# Altium project US29080671(A).PrjPCB (part 1 of 10)
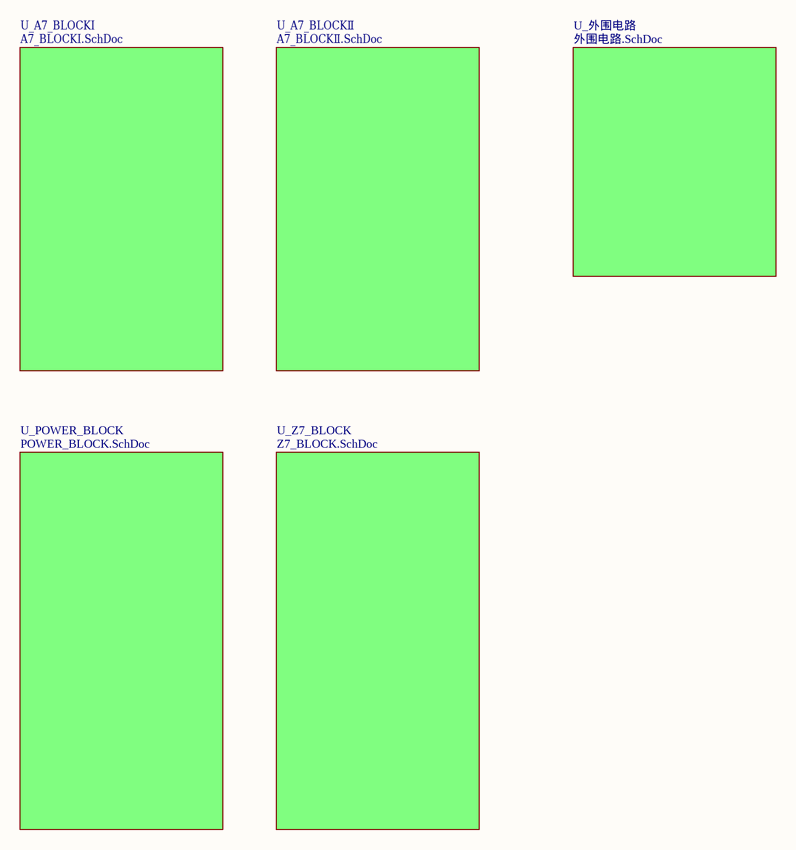
[diagram p0: US29080671.SchDoc]
42 sheets, 1097 parts. Net scope: global (net labels, ports and power ports of the same name join across sheets).
Board file: US29080671(A).PcbDoc
Sheets:
  US29080671.SchDoc
    U_A7_BLOCKⅠ = A7_BLOCKⅠ.SchDoc
      A7_BLOCK_PWR = A7_JTAG&CONFIG.SchDoc
      A7_BLOCK_PWR = A7_MGT.SchDoc
      A7_BLOCK_PWR = A7_POWER.SchDoc
      A7_BLOCK_PWR = A7_GND.SchDoc
      A7_BLOCK_FUN = A7_FUNCTION1.SchDoc
      A7_BLOCK_FUN = A7_FUNCTION2.SchDoc
      A7_BLOCK_FUN = A7_FUNCTION3.SchDoc
    U_A7_BLOCKⅡ = A7_BLOCKⅡ.SchDoc
      A7_BLOCK2_FUN = A7_FUNCTION1 -Ⅱ.SchDoc
      A7_BLOCK2_FUN = A7_FUNCTION2 - Ⅱ.SchDoc
      A7_BLOCK2_FUN = A7_FUNCTION3 - Ⅱ.SchDoc
      A7_BLOCK2_PWR = A7_JTAG&CONFIG - Ⅱ.SchDoc
      A7_BLOCK2_PWR = A7_MGT - Ⅱ.SchDoc
      A7_BLOCK2_PWR = A7_POWER - Ⅱ.SchDoc
      A7_BLOCK2_PWR = A7_GND - Ⅱ.SchDoc
    U_POWER_BLOCK = POWER_BLOCK.SchDoc
      U_POWER_B1 = POWER_B1.SchDoc
      U_POWER_B2 = POWER_B2.SchDoc
      U_POWER_B3 = POWER_B3.SchDoc
      U_MY_beamControl_R_组件电源分配 = MY_beamControl_R_组件电源分配.SchDoc
    U_Z7_BLOCK = Z7_BLOCK.SchDoc
      U_Z7_POWER&JTAG = Z7_POWER1.SchDoc
      U_Z7_POWER&JTAG = Z7_POWER2.SchDoc
      U_Z7_POWER&JTAG = Z7_JTAG&DEBUG.SchDoc
      U_Z7_ARM = Z7_USB.SchDoc
      U_Z7_ARM = Z7_BANK_DDR3.SchDoc
      U_Z7_ARM = Z7_DDR3.SchDoc
      U_Z7_ARM = Z7_BANK500_501.SchDoc
      U_Z7_ARM = Z7_ETHERNET.SchDoc
      U_Z7_ARM = Z7_STORAGE.SchDoc
      U_Z7_ARM = Z7_MGTX.SchDoc
      U_Z7_FUNCTION = Z7_FUNCTION1.SchDoc
      U_Z7_FUNCTION = Z7_FUNCTION2.SchDoc
      U_Z7_FUNCTION = Z7_FUNCTION3.SchDoc
      U_ZYNQ_reset = ZYNQ_reset.SchDoc
    U_外围电路 = 外围电路.SchDoc
      U_MY_beamControl_R_对内接口 = MY_beamControl_R_对内接口.SchDoc
      U_MY_beamControl_R_对外接口 = MY_beamControl_R_对外接口.SchDoc
      U_MY_beamControl_R电平转换 = MY_beamControl_R电平转换.SchDoc
      U_MY_beamControl_R_风扇供电接口 = MY_beamControl_R_风扇供电接口.SchDoc

## Sheet US29080671.SchDoc
size A4

### Sub-sheets
U_A7_BLOCKⅠ = A7_BLOCKⅠ.SchDoc: no entries
U_A7_BLOCKⅡ = A7_BLOCKⅡ.SchDoc: no entries
U_POWER_BLOCK = POWER_BLOCK.SchDoc: no entries
U_Z7_BLOCK = Z7_BLOCK.SchDoc: no entries
U_外围电路 = 外围电路.SchDoc: no entries

## Sheet A7_BLOCKⅠ.SchDoc
size A4
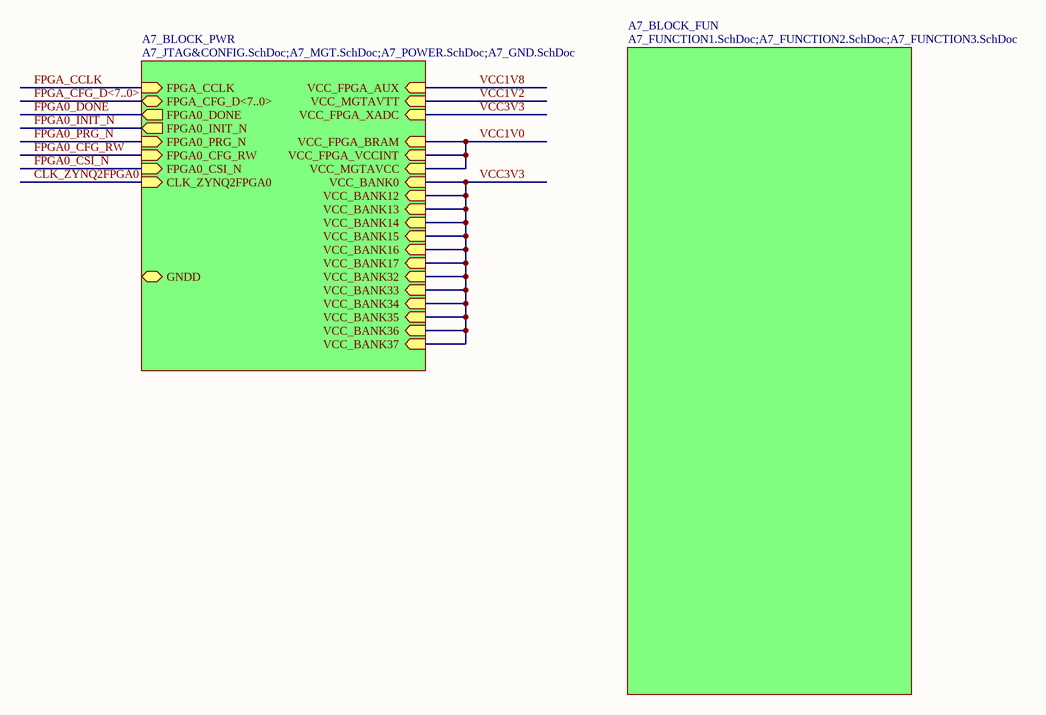
[diagram p1: A7_BLOCKⅠ.SchDoc]

### Sub-sheets
A7_BLOCK_FUN = A7_FUNCTION1.SchDoc;A7_FUNCTION2.SchDoc;A7_FUNCTION3.SchDoc: no entries
A7_BLOCK_PWR = A7_JTAG&CONFIG.SchDoc;A7_MGT.SchDoc;A7_POWER.SchDoc;A7_GND.SchDoc: FPGA_CCLK (in), FPGA0_DONE (out), FPGA0_INIT_N (out), FPGA0_PRG_N (in), GNDD, FPGA_CFG_D<7..0>, CLK_ZYNQ2FPGA0 (in), FPGA0_CFG_RW (in), FPGA0_CSI_N (in), VCC_MGTAVCC (in), VCC_MGTAVTT (in), VCC_BANK0 (in), VCC_FPGA_XADC (in), VCC_FPGA_BRAM (in), VCC_FPGA_VCCINT (in), VCC_FPGA_AUX (in), VCC_BANK12 (in), VCC_BANK13 (in), VCC_BANK14 (in), VCC_BANK15 (in), VCC_BANK16 (in), VCC_BANK17 (in), VCC_BANK32 (in), VCC_BANK33 (in), VCC_BANK34 (in), VCC_BANK35 (in), VCC_BANK36 (in), VCC_BANK37 (in)

### Nets
VCC1V0: sheet A7_BLOCK_PWR/VCC_MGTAVCC, sheet A7_BLOCK_PWR/VCC_FPGA_BRAM, sheet A7_BLOCK_PWR/VCC_FPGA_VCCINT
VCC3V3: sheet A7_BLOCK_PWR/VCC_BANK0, sheet A7_BLOCK_PWR/VCC_FPGA_XADC, sheet A7_BLOCK_PWR/VCC_BANK12, sheet A7_BLOCK_PWR/VCC_BANK13, sheet A7_BLOCK_PWR/VCC_BANK14, sheet A7_BLOCK_PWR/VCC_BANK15, sheet A7_BLOCK_PWR/VCC_BANK16, sheet A7_BLOCK_PWR/VCC_BANK17, sheet A7_BLOCK_PWR/VCC_BANK32, sheet A7_BLOCK_PWR/VCC_BANK33, sheet A7_BLOCK_PWR/VCC_BANK34, sheet A7_BLOCK_PWR/VCC_BANK35, sheet A7_BLOCK_PWR/VCC_BANK36, sheet A7_BLOCK_PWR/VCC_BANK37

### Buses and harness runs
bus FPGA_CFG_D<7..0> = sheet A7_BLOCK_PWR/FPGA_CFG_D<7..0>

## Sheet A7_JTAG&CONFIG.SchDoc
size A3
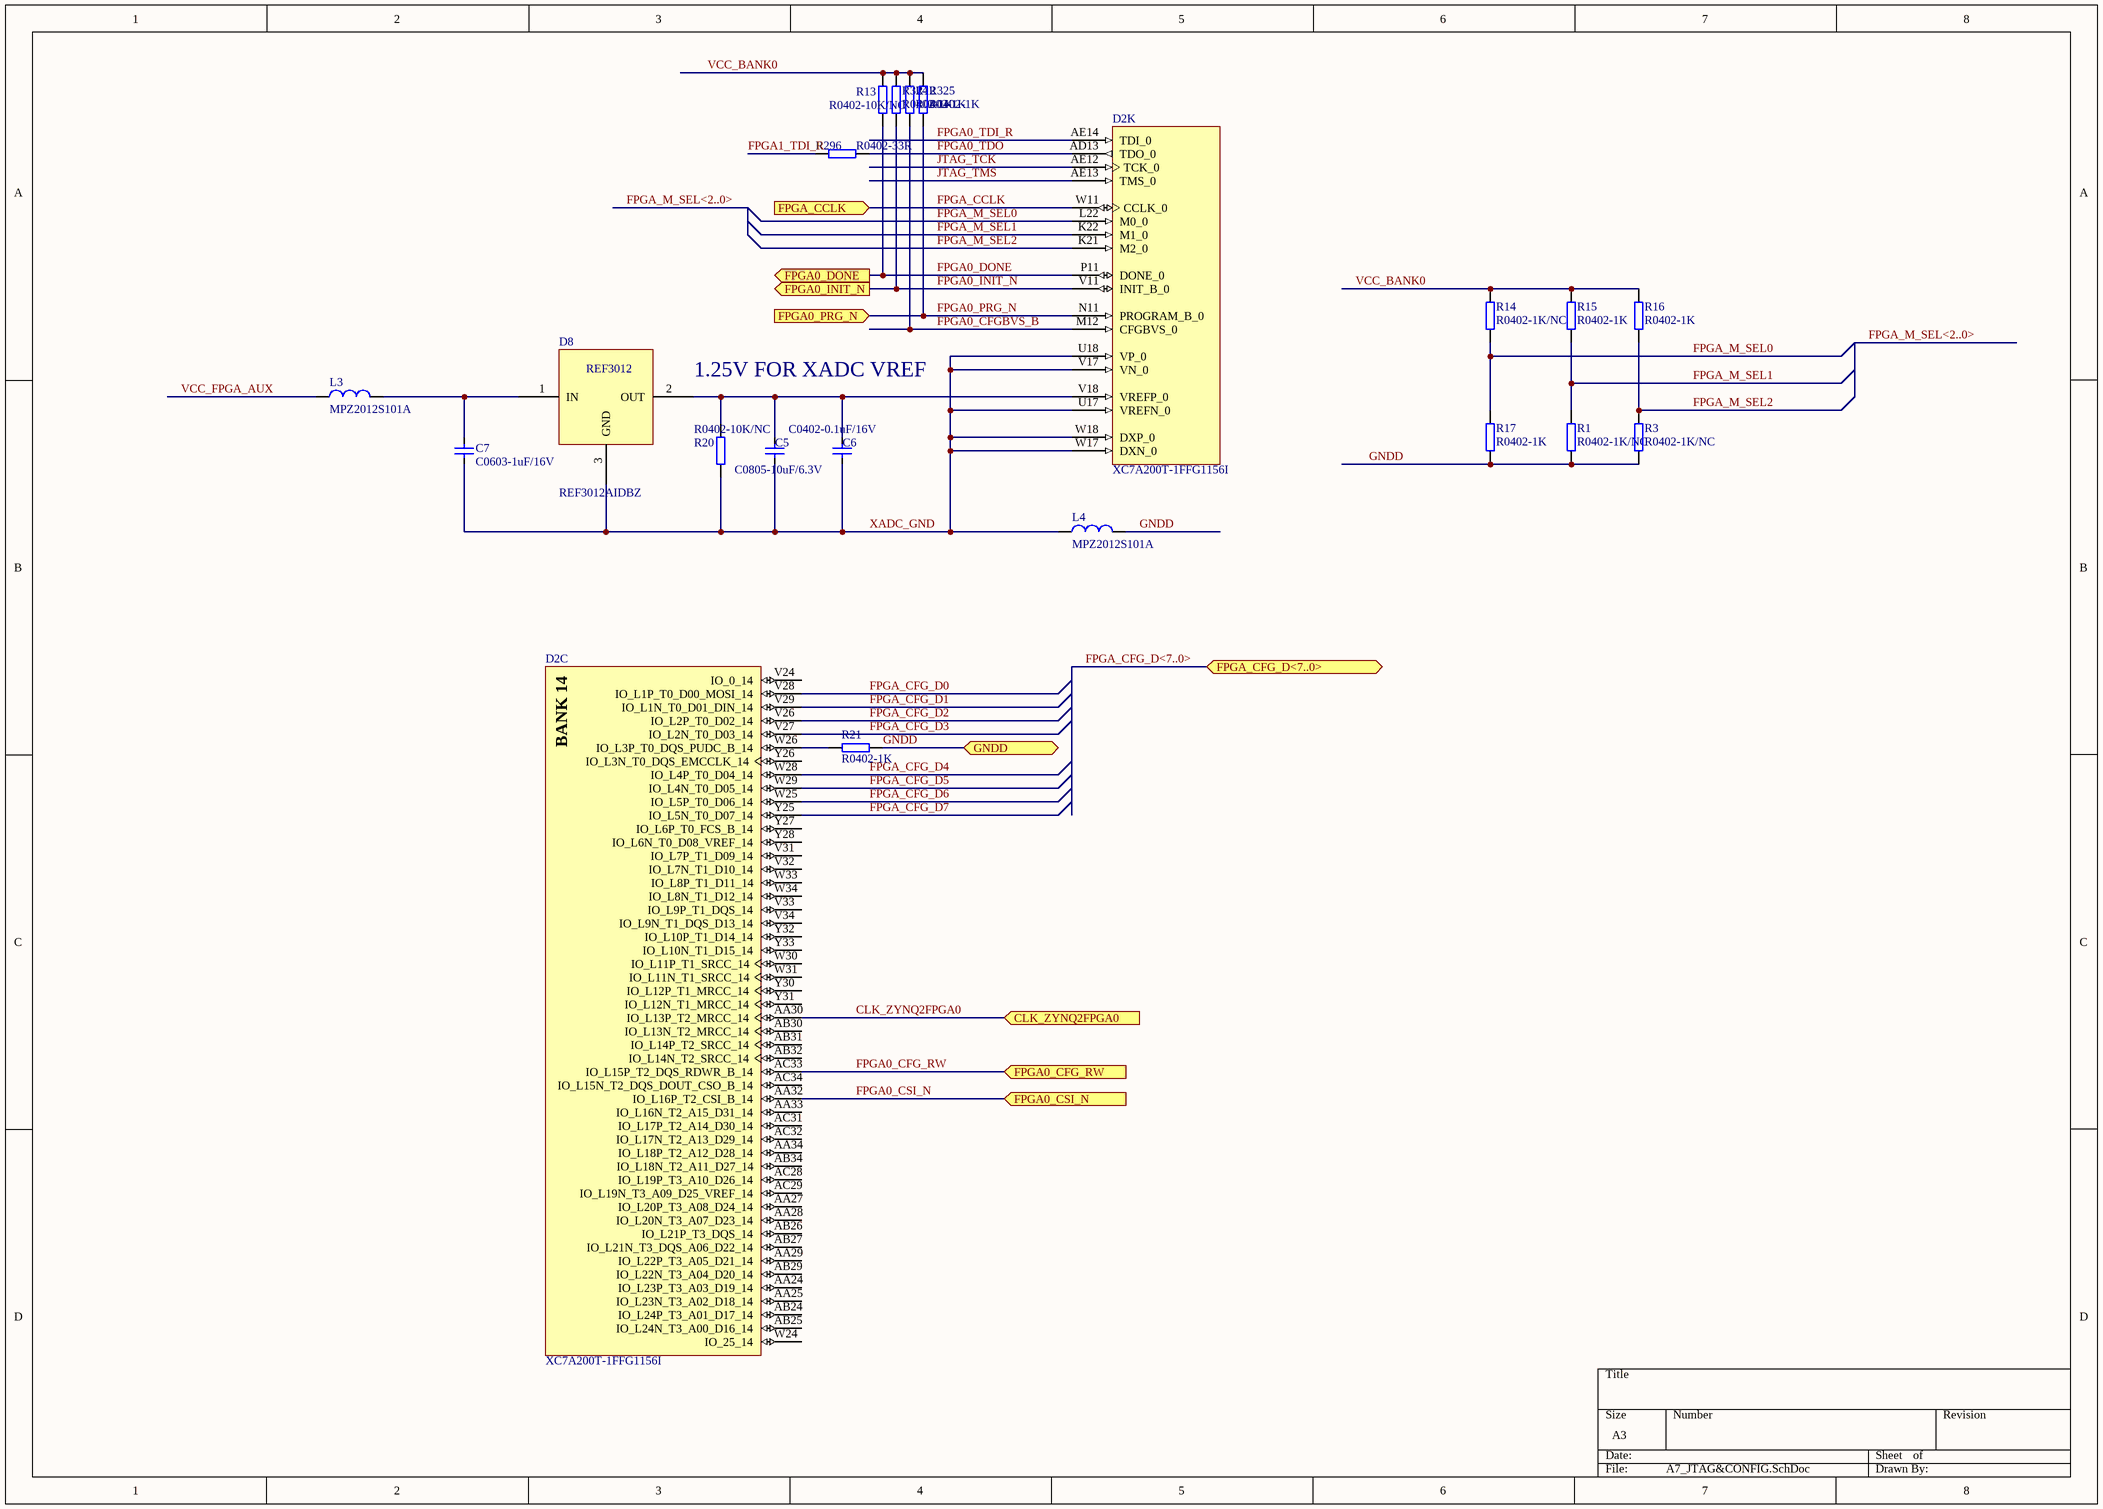
[diagram p2: A7_JTAG&CONFIG.SchDoc]

### Parts
C5  C0805-10uF/6.3V  [C0805]
C6  C0402-0.1uF/16V  [C0402]
C7  C0603-1uF/16V  [C0603]
D2  XC7A200T-1FFG1156I  [FFG1156]  (parts C,K of 18)
D8  REF3012AIDBZ  [SOT-23]
L3  MPZ2012S101A  [R0805]
L4  MPZ2012S101A  [R0805]
R1  R0402-1K/NC  [R0402]
R3  R0402-1K/NC  [R0402]
R12  R0402-1K  [R0402]
R13  R0402-10K/NC  [R0402]
R14  R0402-1K/NC  [R0402]
R15  R0402-1K  [R0402]
R16  R0402-1K  [R0402]
R17  R0402-1K  [R0402]
R20  R0402-10K/NC  [R0402]
R21  R0402-1K  [R0402]
R296  R0402-33R  [R0402]
R324  R0402-1K  [R0402]
R325  R0402-1K  [R0402]

### Ports
CLK_ZYNQ2FPGA0 (in), FPGA0_CFG_RW (in), FPGA0_CSI_N (in), FPGA0_DONE (out), FPGA0_INIT_N (out), FPGA0_PRG_N (in), FPGA_CCLK (in), FPGA_CFG_D<7..0>, GNDD

### Nets
GNDD: L4.2 R1.1 R3.1 R17.1 R21.1 ; port GNDD
VCC_BANK0: R12.2 R13.2 R14.2 R15.2 R16.2 R324.2 R325.2  [project net VCC3V3]
VCC_FPGA_AUX: L3.1  [project net VCC1V8]
CLK_ZYNQ2FPGA0: D2.AA30(IO_L13P_T2_MRCC_14) ; port CLK_ZYNQ2FPGA0
FPGA0_CFG_RW: D2.AC33(IO_L15P_T2_DQS_RDWR_B_14) ; port FPGA0_CFG_RW
FPGA0_CFGBVS_B: D2.M12(CFGBVS_0) R12.1
FPGA0_CSI_N: D2.AA32(IO_L16P_T2_CSI_B_14) ; port FPGA0_CSI_N
FPGA0_DONE: D2.P11(DONE_0) R13.1 ; port FPGA0_DONE
FPGA0_INIT_N: D2.V11(INIT_B_0) R324.1 ; port FPGA0_INIT_N
FPGA0_PRG_N: D2.N11(PROGRAM_B_0) R325.1 ; port FPGA0_PRG_N
FPGA0_TDI_R: D2.AE14(TDI_0)
FPGA0_TDO: D2.AD13(TDO_0) R296.2
FPGA1_TDI_R: R296.1
FPGA_CCLK: D2.W11(CCLK_0) ; port FPGA_CCLK
FPGA_CFG_D0: D2.V28(IO_L1P_T0_D00_MOSI_14)
FPGA_CFG_D1: D2.V29(IO_L1N_T0_D01_DIN_14)
FPGA_CFG_D2: D2.V26(IO_L2P_T0_D02_14)
FPGA_CFG_D3: D2.V27(IO_L2N_T0_D03_14)
FPGA_CFG_D4: D2.W28(IO_L4P_T0_D04_14)
FPGA_CFG_D5: D2.W29(IO_L4N_T0_D05_14)
FPGA_CFG_D6: D2.W25(IO_L5P_T0_D06_14)
FPGA_CFG_D7: D2.Y25(IO_L5N_T0_D07_14)
FPGA_M_SEL0: D2.L22(M0_0) R14.1 R17.2
FPGA_M_SEL1: D2.K22(M1_0) R1.2 R15.1
FPGA_M_SEL2: D2.K21(M2_0) R3.2 R16.1
JTAG_TCK: D2.AE12(TCK_0)
JTAG_TMS: D2.AE13(TMS_0)
XADC_GND: C5.2 C6.2 C7.2 D2.U17(VREFN_0) D2.U18(VP_0) D2.V17(VN_0) D2.W17(DXN_0) D2.W18(DXP_0) D8.3(GND) L4.1 R20.2
NetC5_1: C5.1 C6.1 D2.V18(VREFP_0) D8.2(OUT) R20.1
NetC7_1: C7.1 D8.1(IN) L3.2
NetD2_W26: D2.W26(IO_L3P_T0_DQS_PUDC_B_14) R21.2

Not connected (* = marked no-connect by the designer): D2 AA24(IO_L23P_T3_A03_D19_14) AA25(IO_L23N_T3_A02_D18_14) AA27(IO_L20P_T3_A08_D24_14) AA28(IO_L20N_T3_A07_D23_14) AA29(IO_L22P_T3_A05_D21_14) AA33(IO_L16N_T2_A15_D31_14) AA34(IO_L18P_T2_A12_D28_14) AB24(IO_L24P_T3_A01_D17_14) AB25(IO_L24N_T3_A00_D16_14) AB26(IO_L21P_T3_DQS_14) AB27(IO_L21N_T3_DQS_A06_D22_14) AB29(IO_L22N_T3_A04_D20_14) AB30(IO_L13N_T2_MRCC_14) AB31(IO_L14P_T2_SRCC_14) AB32(IO_L14N_T2_SRCC_14) AB34(IO_L18N_T2_A11_D27_14) AC28(IO_L19P_T3_A10_D26_14) AC29(IO_L19N_T3_A09_D25_VREF_14) AC31(IO_L17P_T2_A14_D30_14) AC32(IO_L17N_T2_A13_D29_14) AC34(IO_L15N_T2_DQS_DOUT_CSO_B_14) V24(IO_0_14) V31(IO_L7P_T1_D09_14) V32(IO_L7N_T1_D10_14) V33(IO_L9P_T1_DQS_14) V34(IO_L9N_T1_DQS_D13_14) W24(IO_25_14) W30(IO_L11P_T1_SRCC_14) W31(IO_L11N_T1_SRCC_14) W33(IO_L8P_T1_D11_14) W34(IO_L8N_T1_D12_14) Y26(IO_L3N_T0_DQS_EMCCLK_14) Y27(IO_L6P_T0_FCS_B_14) Y28(IO_L6N_T0_D08_VREF_14) Y30(IO_L12P_T1_MRCC_14) Y31(IO_L12N_T1_MRCC_14) Y32(IO_L10P_T1_D14_14) Y33(IO_L10N_T1_D15_14)

### Buses and harness runs
bus FPGA_CFG_D<7..0> = port FPGA_CFG_D<7..0>
bus FPGA_M_SEL<2..0>

### Notes on the sheet
- 1.25V FOR XADC VREF
- (in symbol XC7A200T-1FFG1156I, part C) BANK 14

### Library data of the parts
C5 = C1210-22uF/16V: Part_number: C0805-10uF/6.3V; Part_type: CAP; Value: C0805-10uF/6.3V; Schematic_Part: CAP; PCB_Footprint: C0805
C6 = C0402-0.1uF/16V: X7R; Manufacturer: SAMSUNG; Manufacturer_p/n: CL05X7R104KO5NNN; Part_number: C0402-0.1uF/16V; Part_type: CAP; Value: C0402-0.1uF/16V; temperature: -55℃\+125℃; Schematic_Part: CAP; PCB_Footprint: C0402; datasheet: #DataSheet\C_Samsung_General Capacitors.pdf#
C7 = C0603-100nF/16V: X7R; Part_number: C0603-1uF/16V; Part_type: CAP; Value: C0603-1uF/16V; temperature: -55℃\+125℃; Schematic_Part: CAP; PCB_Footprint: C0603
D2 = XC7A200T-1FFG1156I: Artix-7 FPGA, 500 User I/Os, 16 GTP, 1156-Ball BGA, Speed Grade 1, Industrial Grade, Pb-Free; Manufacturer: Xilinx; Block RAM Blocks (18Kb): 730; Block RAM Blocks (36Kb): 365; Block RAM Blocks (Max Kb): 13140; CLBs (Slices): 33650; Clock Mgmt Tiles (CMTs): 10; DSP48E1 Slices: 740; Logic Cells: 215360; Max User I/O: 500; Speed Grade: -1; DatasheetVersion: v1.12; PackageVersion: Rev 1.8; PackageReference: FFG1156; PackageDescription: Flip-Chip BGA, Body 35 x 35 mm, 1.0 mm Pitch; CLBs (Max Distributed RAM Kb): 2888; Generic Part Number: XC7A200T; RoHS: Pb-Free; Mounting Technology: Surface Mount; Code_JEDEC: MS-034-AAR-1; PartNumber: XC7A200T-1FFG1156I; ComponentLink1Description: Datasheet; ComponentLink1URL: http://www.xilinx.com/support/documentation/data_sheets/ds180_7Series_Overview.pdf; ComponentLink2Description: Package Specification; ComponentLink2URL: http://www.xilinx.com/support/documentation/user_guides/ug475_7Series_Pkg_Pinout.pdf; ComponentLink3Description: DC and Switching Characteristics; ComponentLink3URL: http://www.xilinx.com/support/documentation/data_sheets/ds181_Artix_7_Data_Sheet.pdf; ComponentLink4Description: Package File; ComponentLink4URL: http://www.xilinx.com/support/packagefiles/a7packages/xc7a200tfbg676pkg.txt; ComponentLink5Description: Packaging and Pinout; ComponentLink5URL: http://www.xilinx.com/support/documentation/user_guides/ug475_7Series_Pkg_Pinout.pdf
L3 L4 = FB0805-330R@100MHz: Manufacturer: TDK; Part_number: MPZ2012S101A; Part_type: BEAD; temperature: -55℃\+125℃; Value1: 330R@100MHz; Schematic_Part: BEAD; PCB_Footprint: R0805; Manufacturer_p/n: MPZ2012S101A
R1 R3 R12-R17 R20 R21 R296 R324 R325 = R0402-10K: Manufacturer: SAMSUNG; Part_type: RES; Schematic_Part: RES; PCB_Footprint: R0402
  R1 R3 R14: Part_number: R0402-1K/NC; Value: R0402-1K/NC
  R12 R15-R17 R21 R324 R325: Part_number: R0402-1K; Value: R0402-1K
  R13 R20: Part_number: R0402-10K/NC; Value: R0402-10K/NC
  R296: Part_number: R0402-33R; Value: R0402-33R
D8 = REF3012AIDBZ: Part_number: REF3012AIDBZ

## Sheet A7_MGT.SchDoc
size A3
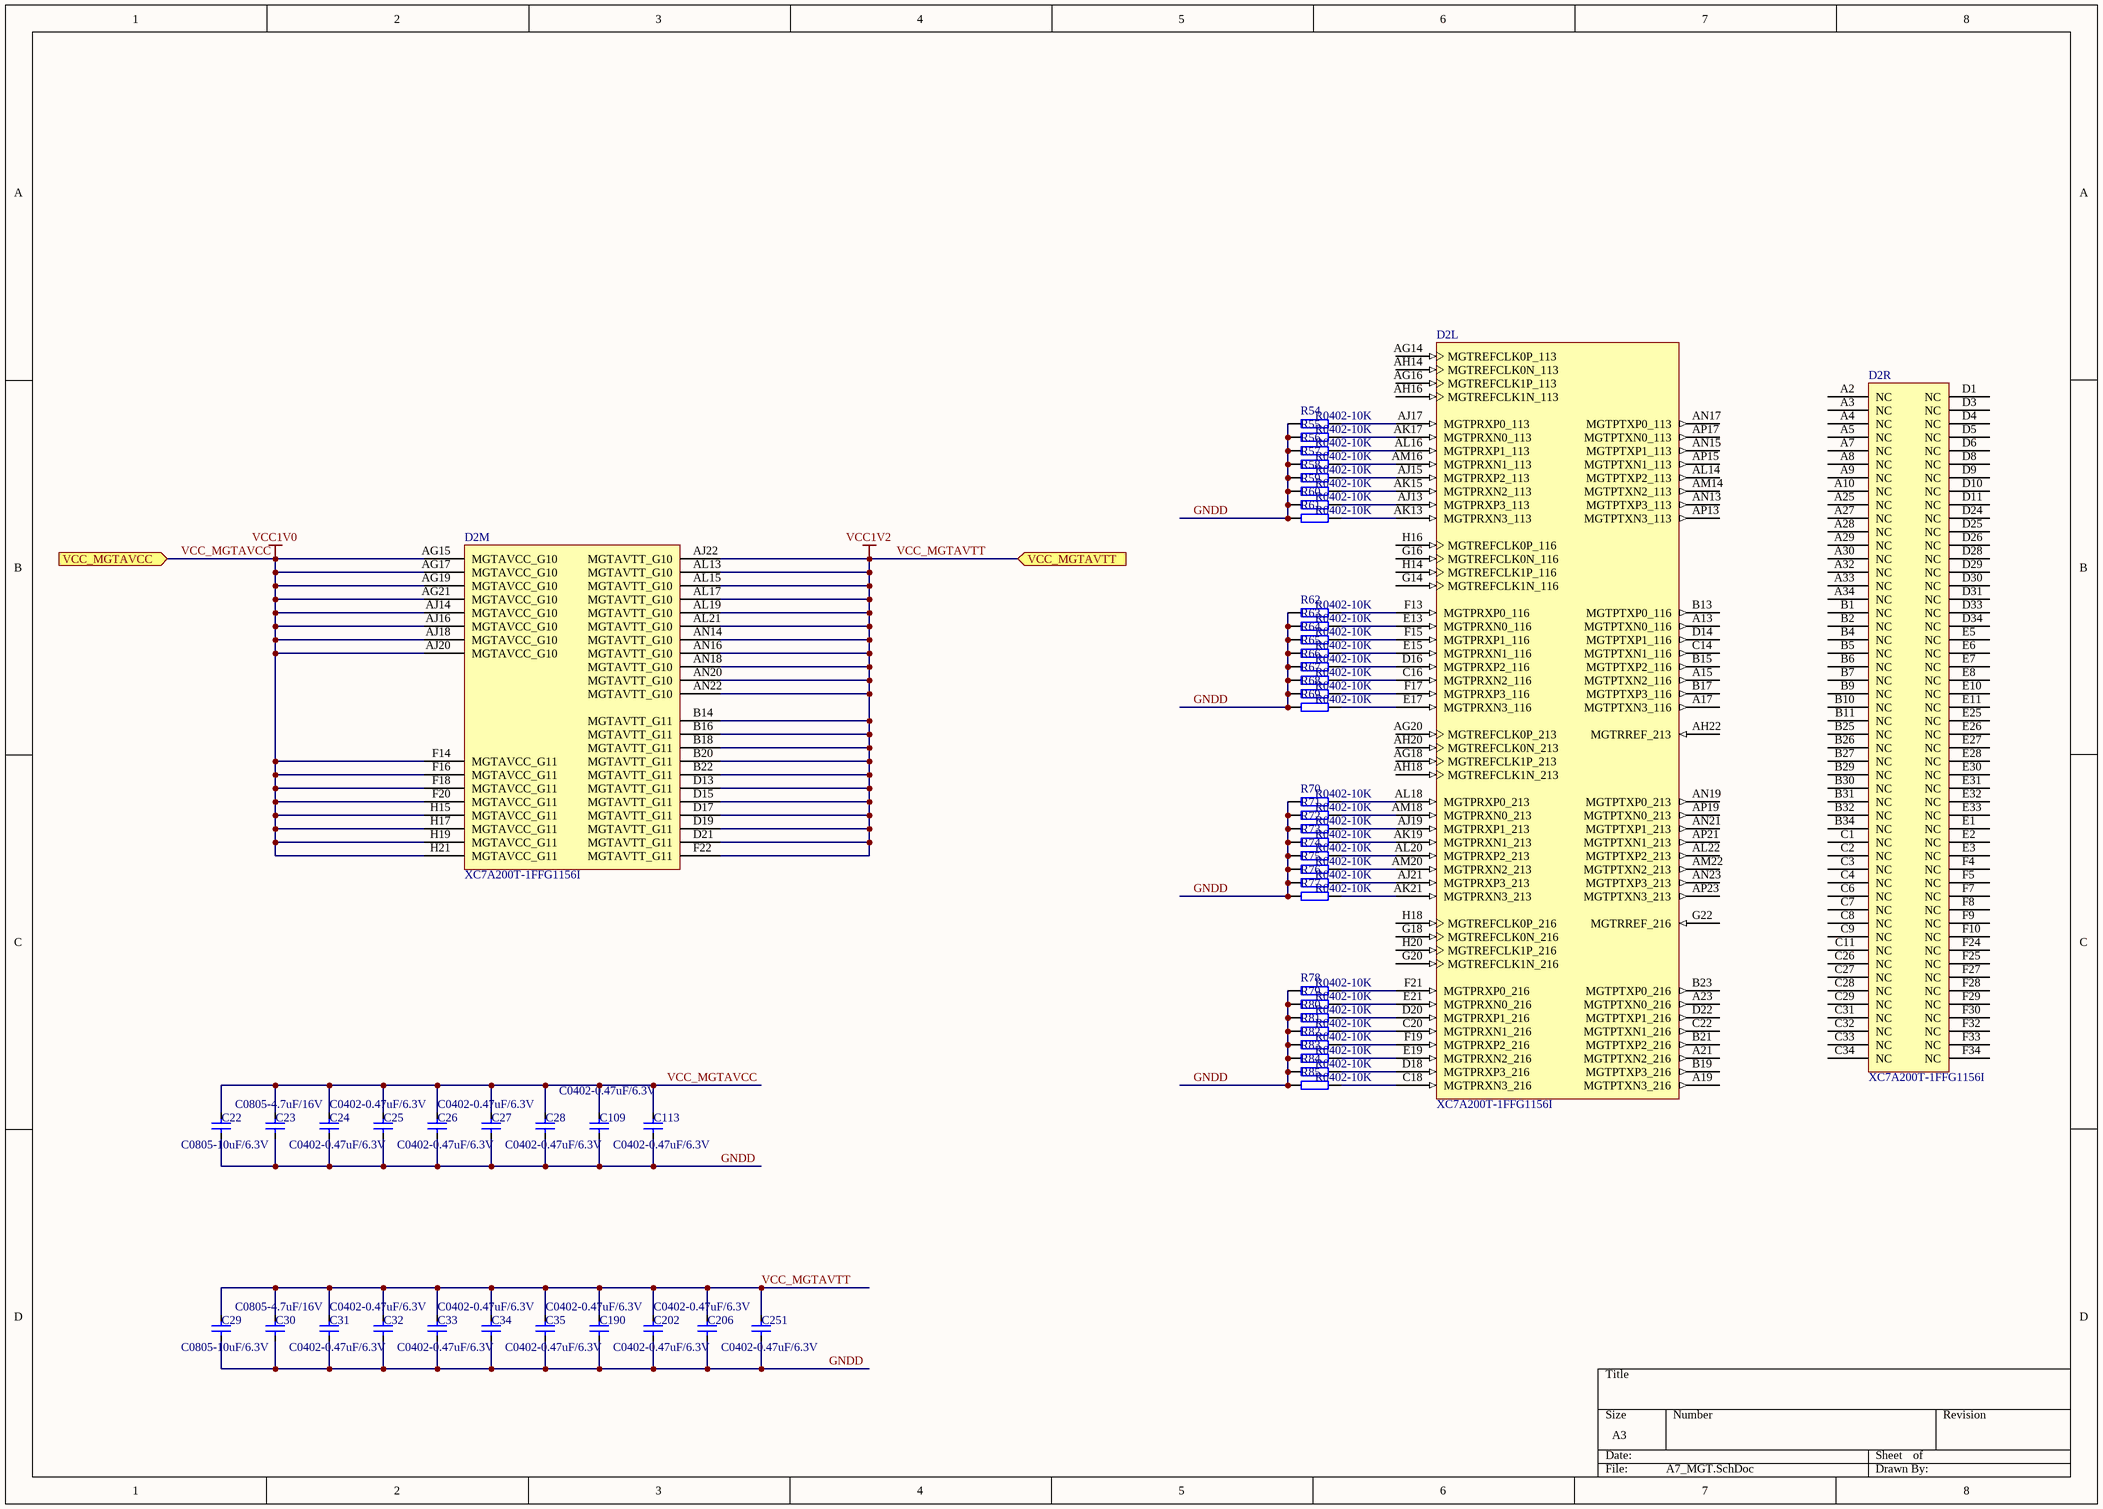
[diagram p3: A7_MGT.SchDoc]

### Parts
C22  C0805-10uF/6.3V  [C0805]
C23  C0805-4.7uF/16V  [C0805]
C24  C0402-0.47uF/6.3V  [C0402]
C25  C0402-0.47uF/6.3V  [C0402]
C26  C0402-0.47uF/6.3V  [C0402]
C27  C0402-0.47uF/6.3V  [C0402]
C28  C0402-0.47uF/6.3V  [C0402]
C29  C0805-10uF/6.3V  [C0805]
C30  C0805-4.7uF/16V  [C0805]
C31  C0402-0.47uF/6.3V  [C0402]
C32  C0402-0.47uF/6.3V  [C0402]
C33  C0402-0.47uF/6.3V  [C0402]
C34  C0402-0.47uF/6.3V  [C0402]
C35  C0402-0.47uF/6.3V  [C0402]
C109  C0402-0.47uF/6.3V  [C0402]
C113  C0402-0.47uF/6.3V  [C0402]
C190  C0402-0.47uF/6.3V  [C0402]
C202  C0402-0.47uF/6.3V  [C0402]
C206  C0402-0.47uF/6.3V  [C0402]
C251  C0402-0.47uF/6.3V  [C0402]
D2  XC7A200T-1FFG1156I  [FFG1156]  (parts L,M,R of 18)
R54  R0402-10K  [R0402]
R55  R0402-10K  [R0402]
R56  R0402-10K  [R0402]
R57  R0402-10K  [R0402]
R58  R0402-10K  [R0402]
R59  R0402-10K  [R0402]
R60  R0402-10K  [R0402]
R61  R0402-10K  [R0402]
R62  R0402-10K  [R0402]
R63  R0402-10K  [R0402]
R64  R0402-10K  [R0402]
R65  R0402-10K  [R0402]
R66  R0402-10K  [R0402]
R67  R0402-10K  [R0402]
R68  R0402-10K  [R0402]
R69  R0402-10K  [R0402]
R70  R0402-10K  [R0402]
R71  R0402-10K  [R0402]
R72  R0402-10K  [R0402]
R73  R0402-10K  [R0402]
R74  R0402-10K  [R0402]
R75  R0402-10K  [R0402]
R76  R0402-10K  [R0402]
R77  R0402-10K  [R0402]
R78  R0402-10K  [R0402]
R79  R0402-10K  [R0402]
R80  R0402-10K  [R0402]
R81  R0402-10K  [R0402]
R82  R0402-10K  [R0402]
R83  R0402-10K  [R0402]
R84  R0402-10K  [R0402]
R85  R0402-10K  [R0402]

### Ports
VCC_MGTAVCC (in), VCC_MGTAVTT (in)

### Nets
GNDD: C22.2 C23.2 C24.2 C25.2 C26.2 C27.2 C28.2 C29.2 C30.2 C31.2 C32.2 C33.2 C34.2 C35.2 C109.2 C113.2 C190.2 C202.2 C206.2 C251.2 R54.1 R55.1 R56.1 R57.1 R58.1 R59.1 R60.1 R61.1 R62.1 R63.1 R64.1 R65.1 R66.1 R67.1 R68.1 R69.1 R70.1 R71.1 R72.1 R73.1 R74.1 R75.1 R76.1 R77.1 R78.1 R79.1 R80.1 R81.1 R82.1 R83.1 R84.1 R85.1
VCC1V0: C22.1 C23.1 C24.1 C25.1 C26.1 C27.1 C28.1 C109.1 C113.1 D2.AG15(MGTAVCC_G10) D2.AG17(MGTAVCC_G10) D2.AG19(MGTAVCC_G10) D2.AG21(MGTAVCC_G10) D2.AJ14(MGTAVCC_G10) D2.AJ16(MGTAVCC_G10) D2.AJ18(MGTAVCC_G10) D2.AJ20(MGTAVCC_G10) D2.F14(MGTAVCC_G11) D2.F16(MGTAVCC_G11) D2.F18(MGTAVCC_G11) D2.F20(MGTAVCC_G11) D2.H15(MGTAVCC_G11) D2.H17(MGTAVCC_G11) D2.H19(MGTAVCC_G11) D2.H21(MGTAVCC_G11) ; port VCC_MGTAVCC  [also labelled VCC_MGTAVCC]
VCC1V2: C29.1 C30.1 C31.1 C32.1 C33.1 C34.1 C35.1 C190.1 C202.1 C206.1 C251.1 D2.AJ22(MGTAVTT_G10) D2.AL13(MGTAVTT_G10) D2.AL15(MGTAVTT_G10) D2.AL17(MGTAVTT_G10) D2.AL19(MGTAVTT_G10) D2.AL21(MGTAVTT_G10) D2.AN14(MGTAVTT_G10) D2.AN16(MGTAVTT_G10) D2.AN18(MGTAVTT_G10) D2.AN20(MGTAVTT_G10) D2.AN22(MGTAVTT_G10) D2.B14(MGTAVTT_G11) D2.B16(MGTAVTT_G11) D2.B18(MGTAVTT_G11) D2.B20(MGTAVTT_G11) D2.B22(MGTAVTT_G11) D2.D13(MGTAVTT_G11) D2.D15(MGTAVTT_G11) D2.D17(MGTAVTT_G11) D2.D19(MGTAVTT_G11) D2.D21(MGTAVTT_G11) D2.F22(MGTAVTT_G11) ; port VCC_MGTAVTT  [also labelled VCC_MGTAVTT]
NetD2_AJ13: D2.AJ13(MGTPRXP3_113) R60.2
NetD2_AJ15: D2.AJ15(MGTPRXP2_113) R58.2
NetD2_AJ17: D2.AJ17(MGTPRXP0_113) R54.2
NetD2_AJ19: D2.AJ19(MGTPRXP1_213) R72.2
NetD2_AJ21: D2.AJ21(MGTPRXP3_213) R76.2
NetD2_AK13: D2.AK13(MGTPRXN3_113) R61.2
NetD2_AK15: D2.AK15(MGTPRXN2_113) R59.2
NetD2_AK17: D2.AK17(MGTPRXN0_113) R55.2
NetD2_AK19: D2.AK19(MGTPRXN1_213) R73.2
NetD2_AK21: D2.AK21(MGTPRXN3_213) R77.2
NetD2_AL16: D2.AL16(MGTPRXP1_113) R56.2
NetD2_AL18: D2.AL18(MGTPRXP0_213) R70.2
NetD2_AL20: D2.AL20(MGTPRXP2_213) R74.2
NetD2_AM16: D2.AM16(MGTPRXN1_113) R57.2
NetD2_AM18: D2.AM18(MGTPRXN0_213) R71.2
NetD2_AM20: D2.AM20(MGTPRXN2_213) R75.2
NetD2_C16: D2.C16(MGTPRXN2_116) R67.2
NetD2_C18: D2.C18(MGTPRXN3_216) R85.2
NetD2_C20: D2.C20(MGTPRXN1_216) R81.2
NetD2_D16: D2.D16(MGTPRXP2_116) R66.2
NetD2_D18: D2.D18(MGTPRXP3_216) R84.2
NetD2_D20: D2.D20(MGTPRXP1_216) R80.2
NetD2_E13: D2.E13(MGTPRXN0_116) R63.2
NetD2_E15: D2.E15(MGTPRXN1_116) R65.2
NetD2_E17: D2.E17(MGTPRXN3_116) R69.2
NetD2_E19: D2.E19(MGTPRXN2_216) R83.2
NetD2_E21: D2.E21(MGTPRXN0_216) R79.2
NetD2_F13: D2.F13(MGTPRXP0_116) R62.2
NetD2_F15: D2.F15(MGTPRXP1_116) R64.2
NetD2_F17: D2.F17(MGTPRXP3_116) R68.2
NetD2_F19: D2.F19(MGTPRXP2_216) R82.2
NetD2_F21: D2.F21(MGTPRXP0_216) R78.2

Not connected (* = marked no-connect by the designer): D2 A2(NC) A3(NC) A4(NC) A5(NC) A7(NC) A8(NC) A9(NC) A10(NC) A13(MGTPTXN0_116) A15(MGTPTXN2_116) A17(MGTPTXN3_116) A19(MGTPTXN3_216) A21(MGTPTXN2_216) A23(MGTPTXN0_216) A25(NC) A27(NC) A28(NC) A29(NC) A30(NC) A32(NC) A33(NC) A34(NC) AG14(MGTREFCLK0P_113) AG16(MGTREFCLK1P_113) AG18(MGTREFCLK1P_213) AG20(MGTREFCLK0P_213) AH14(MGTREFCLK0N_113) AH16(MGTREFCLK1N_113) AH18(MGTREFCLK1N_213) AH20(MGTREFCLK0N_213) AH22(MGTRREF_213) AL14(MGTPTXP2_113) AL22(MGTPTXP2_213) AM14(MGTPTXN2_113) AM22(MGTPTXN2_213) AN13(MGTPTXP3_113) AN15(MGTPTXP1_113) AN17(MGTPTXP0_113) AN19(MGTPTXP0_213) AN21(MGTPTXP1_213) AN23(MGTPTXP3_213) AP13(MGTPTXN3_113) AP15(MGTPTXN1_113) AP17(MGTPTXN0_113) AP19(MGTPTXN0_213) AP21(MGTPTXN1_213) AP23(MGTPTXN3_213) B1(NC) B2(NC) B4(NC) B5(NC) B6(NC) B7(NC) B9(NC) B10(NC) B11(NC) B13(MGTPTXP0_116) B15(MGTPTXP2_116) B17(MGTPTXP3_116) B19(MGTPTXP3_216) B21(MGTPTXP2_216) B23(MGTPTXP0_216) B25(NC) B26(NC) B27(NC) B29(NC) B30(NC) B31(NC) B32(NC) B34(NC) C1(NC) C2(NC) C3(NC) C4(NC) C6(NC) C7(NC) C8(NC) C9(NC) C11(NC) C14(MGTPTXN1_116) C22(MGTPTXN1_216) C26(NC) C27(NC) C28(NC) C29(NC) C31(NC) C32(NC) C33(NC) C34(NC) D1(NC) D3(NC) D4(NC) D5(NC) D6(NC) D8(NC) D9(NC) D10(NC) D11(NC) D14(MGTPTXP1_116) D22(MGTPTXP1_216) D24(NC) D25(NC) D26(NC) D28(NC) D29(NC) D30(NC) D31(NC) D33(NC) D34(NC) E1(NC) E2(NC) E3(NC) E5(NC) E6(NC) E7(NC) E8(NC) E10(NC) E11(NC) E25(NC) E26(NC) E27(NC) E28(NC) E30(NC) E31(NC) E32(NC) E33(NC) F4(NC) F5(NC) F7(NC) F8(NC) F9(NC) F10(NC) F24(NC) F25(NC) F27(NC) F28(NC) F29(NC) F30(NC) F32(NC) F33(NC) F34(NC) G14(MGTREFCLK1N_116) G16(MGTREFCLK0N_116) G18(MGTREFCLK0N_216) G20(MGTREFCLK1N_216) G22(MGTRREF_216) H14(MGTREFCLK1P_116) H16(MGTREFCLK0P_116) H18(MGTREFCLK0P_216) H20(MGTREFCLK1P_216)

### Library data of the parts
C22 C29 = C1210-22uF/16V: Part_number: C0805-10uF/6.3V; Part_type: CAP; Value: C0805-10uF/6.3V; Schematic_Part: CAP; PCB_Footprint: C0805
C23 C30 = C0805-4.7uF/50V: X7R; Manufacturer: SAMSUNG; Part_number: C0805-4.7uF/16V; Part_type: CAP; Value: C0805-4.7uF/16V; Schematic_Part: CAP; PCB_Footprint: C0805; datasheet: #DataSheet\C_Samsung_General Capacitors.pdf#
C24-C28 C31-C35 C109 C113 C190 C202 C206 C251 = C0402-0.1uF/16V: as C6 on sheet A7_JTAG&CONFIG; Part_number: C0402-0.47uF/6.3V; Part_type: CAP; Value: C0402-0.47uF/6.3V; temperature: -55℃\+125℃; Schematic_Part: CAP; PCB_Footprint: C0402; datasheet: #DataSheet\C_Samsung_General Capacitors.pdf#
D2 = XC7A200T-1FFG1156I: as D2 on sheet A7_JTAG&CONFIG; DatasheetVersion: v1.12; PackageVersion: Rev 1.8; PackageReference: FFG1156; PackageDescription: Flip-Chip BGA, Body 35 x 35 mm, 1.0 mm Pitch; CLBs (Max Distributed RAM Kb): 2888; Generic Part Number: XC7A200T; RoHS: Pb-Free; Mounting Technology: Surface Mount; Code_JEDEC: MS-034-AAR-1; PartNumber: XC7A200T-1FFG1156I; ComponentLink1Description: Datasheet; ComponentLink1URL: http://www.xilinx.com/support/documentation/data_sheets/ds180_7Series_Overview.pdf; ComponentLink2Description: Package Specification; ComponentLink2URL: http://www.xilinx.com/support/documentation/user_guides/ug475_7Series_Pkg_Pinout.pdf; ComponentLink3Description: DC and Switching Characteristics; ComponentLink3URL: http://www.xilinx.com/support/documentation/data_sheets/ds181_Artix_7_Data_Sheet.pdf; ComponentLink4Description: Package File; ComponentLink4URL: http://www.xilinx.com/support/packagefiles/a7packages/xc7a200tfbg676pkg.txt; ComponentLink5Description: Packaging and Pinout; ComponentLink5URL: http://www.xilinx.com/support/documentation/user_guides/ug475_7Series_Pkg_Pinout.pdf
R54-R85 = R0402-10K: Manufacturer: SAMSUNG; Part_number: R0402-10K; Part_type: RES; Value: R0402-10K; Schematic_Part: RES; PCB_Footprint: R0402

## Sheet A7_POWER.SchDoc
size A3
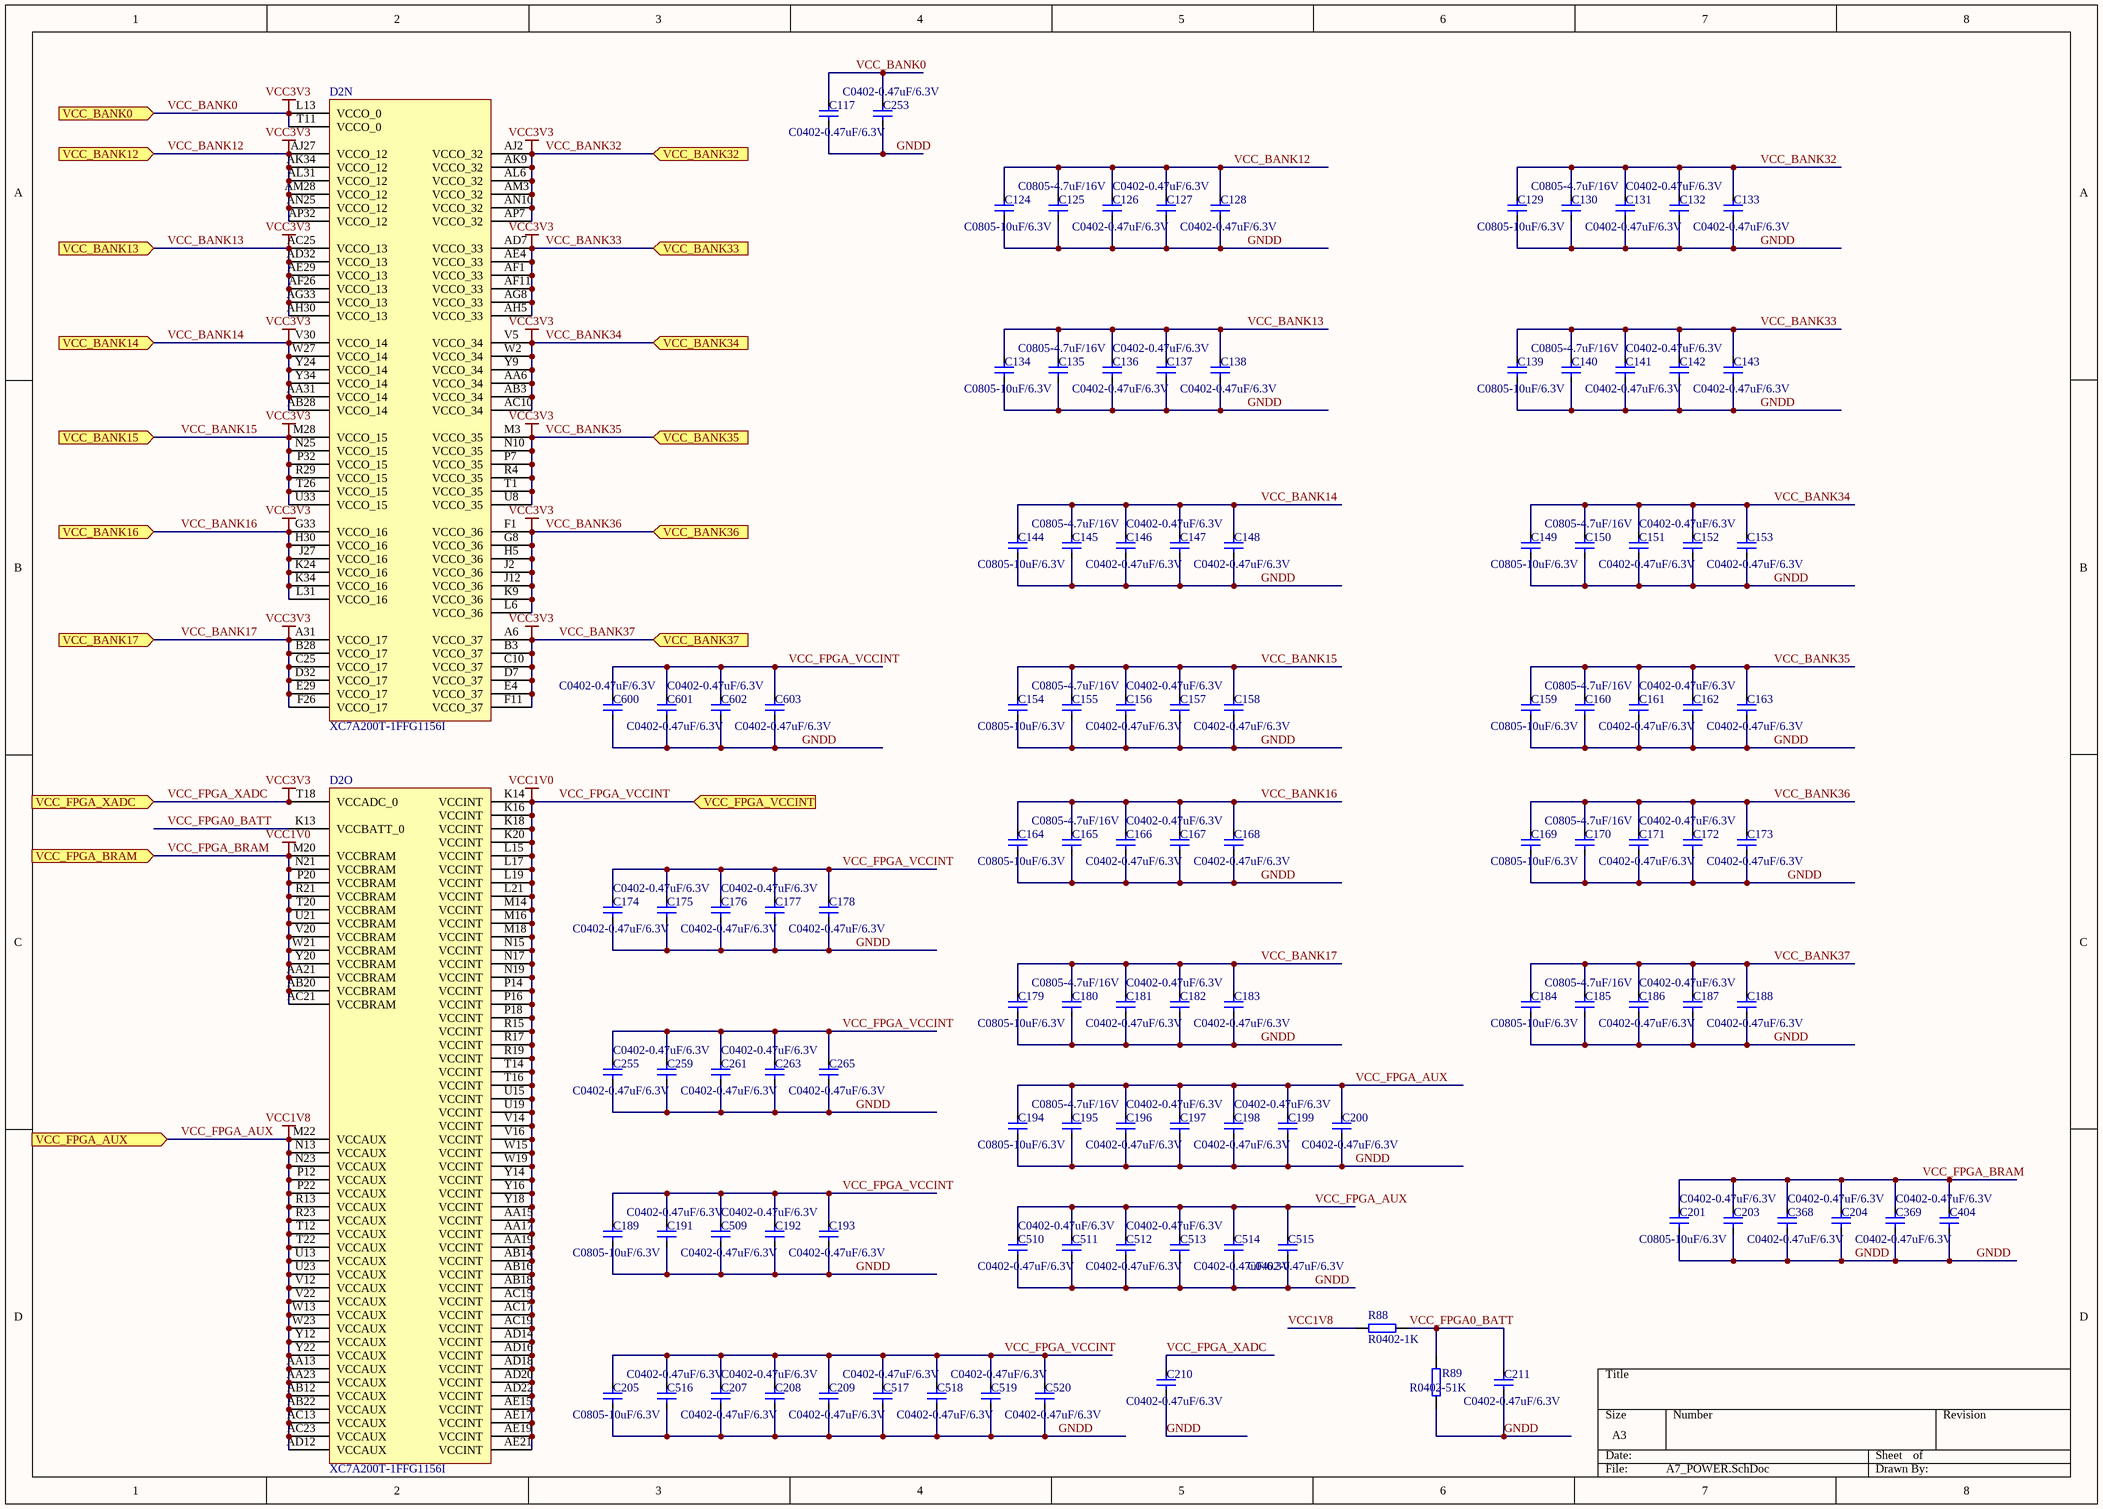
[diagram p4: A7_POWER.SchDoc]

### Parts
C117  C0402-0.47uF/6.3V  [C0402]
C124  C0805-10uF/6.3V  [C0805]
C125  C0805-4.7uF/16V  [C0805]
C126  C0402-0.47uF/6.3V  [C0402]
C127  C0402-0.47uF/6.3V  [C0402]
C128  C0402-0.47uF/6.3V  [C0402]
C129  C0805-10uF/6.3V  [C0805]
C130  C0805-4.7uF/16V  [C0805]
C131  C0402-0.47uF/6.3V  [C0402]
C132  C0402-0.47uF/6.3V  [C0402]
C133  C0402-0.47uF/6.3V  [C0402]
C134  C0805-10uF/6.3V  [C0805]
C135  C0805-4.7uF/16V  [C0805]
C136  C0402-0.47uF/6.3V  [C0402]
C137  C0402-0.47uF/6.3V  [C0402]
C138  C0402-0.47uF/6.3V  [C0402]
C139  C0805-10uF/6.3V  [C0805]
C140  C0805-4.7uF/16V  [C0805]
C141  C0402-0.47uF/6.3V  [C0402]
C142  C0402-0.47uF/6.3V  [C0402]
C143  C0402-0.47uF/6.3V  [C0402]
C144  C0805-10uF/6.3V  [C0805]
C145  C0805-4.7uF/16V  [C0805]
C146  C0402-0.47uF/6.3V  [C0402]
C147  C0402-0.47uF/6.3V  [C0402]
C148  C0402-0.47uF/6.3V  [C0402]
C149  C0805-10uF/6.3V  [C0805]
C150  C0805-4.7uF/16V  [C0805]
C151  C0402-0.47uF/6.3V  [C0402]
C152  C0402-0.47uF/6.3V  [C0402]
C153  C0402-0.47uF/6.3V  [C0402]
C154  C0805-10uF/6.3V  [C0805]
C155  C0805-4.7uF/16V  [C0805]
C156  C0402-0.47uF/6.3V  [C0402]
C157  C0402-0.47uF/6.3V  [C0402]
C158  C0402-0.47uF/6.3V  [C0402]
C159  C0805-10uF/6.3V  [C0805]
C160  C0805-4.7uF/16V  [C0805]
C161  C0402-0.47uF/6.3V  [C0402]
C162  C0402-0.47uF/6.3V  [C0402]
C163  C0402-0.47uF/6.3V  [C0402]
C164  C0805-10uF/6.3V  [C0805]
C165  C0805-4.7uF/16V  [C0805]
C166  C0402-0.47uF/6.3V  [C0402]
C167  C0402-0.47uF/6.3V  [C0402]
C168  C0402-0.47uF/6.3V  [C0402]
C169  C0805-10uF/6.3V  [C0805]
C170  C0805-4.7uF/16V  [C0805]
C171  C0402-0.47uF/6.3V  [C0402]
C172  C0402-0.47uF/6.3V  [C0402]
C173  C0402-0.47uF/6.3V  [C0402]
C174  C0402-0.47uF/6.3V  [C0402]
C175  C0402-0.47uF/6.3V  [C0402]
C176  C0402-0.47uF/6.3V  [C0402]
C177  C0402-0.47uF/6.3V  [C0402]
C178  C0402-0.47uF/6.3V  [C0402]
C179  C0805-10uF/6.3V  [C0805]
C180  C0805-4.7uF/16V  [C0805]
C181  C0402-0.47uF/6.3V  [C0402]
C182  C0402-0.47uF/6.3V  [C0402]
C183  C0402-0.47uF/6.3V  [C0402]
C184  C0805-10uF/6.3V  [C0805]
C185  C0805-4.7uF/16V  [C0805]
C186  C0402-0.47uF/6.3V  [C0402]
C187  C0402-0.47uF/6.3V  [C0402]
C188  C0402-0.47uF/6.3V  [C0402]
C189  C0805-10uF/6.3V  [C0805]
C191  C0402-0.47uF/6.3V  [C0402]
C192  C0402-0.47uF/6.3V  [C0402]
C193  C0402-0.47uF/6.3V  [C0402]
C194  C0805-10uF/6.3V  [C0805]
C195  C0805-4.7uF/16V  [C0805]
C196  C0402-0.47uF/6.3V  [C0402]
C197  C0402-0.47uF/6.3V  [C0402]
C198  C0402-0.47uF/6.3V  [C0402]
C199  C0402-0.47uF/6.3V  [C0402]
C200  C0402-0.47uF/6.3V  [C0402]
C201  C0805-10uF/6.3V  [C0805]
C203  C0402-0.47uF/6.3V  [C0402]
C204  C0402-0.47uF/6.3V  [C0402]
C205  C0805-10uF/6.3V  [C0805]
C207  C0402-0.47uF/6.3V  [C0402]
C208  C0402-0.47uF/6.3V  [C0402]
C209  C0402-0.47uF/6.3V  [C0402]
C210  C0402-0.47uF/6.3V  [C0402]
C211  C0402-0.47uF/6.3V  [C0402]
C253  C0402-0.47uF/6.3V  [C0402]
C255  C0402-0.47uF/6.3V  [C0402]
C259  C0402-0.47uF/6.3V  [C0402]
C261  C0402-0.47uF/6.3V  [C0402]
C263  C0402-0.47uF/6.3V  [C0402]
C265  C0402-0.47uF/6.3V  [C0402]
C368  C0402-0.47uF/6.3V  [C0402]
C369  C0402-0.47uF/6.3V  [C0402]
C404  C0402-0.47uF/6.3V  [C0402]
C509  C0402-0.47uF/6.3V  [C0402]
C510  C0402-0.47uF/6.3V  [C0402]
C511  C0402-0.47uF/6.3V  [C0402]
C512  C0402-0.47uF/6.3V  [C0402]
C513  C0402-0.47uF/6.3V  [C0402]
C514  C0402-0.47uF/6.3V  [C0402]
C515  C0402-0.47uF/6.3V  [C0402]
C516  C0402-0.47uF/6.3V  [C0402]
C517  C0402-0.47uF/6.3V  [C0402]
C518  C0402-0.47uF/6.3V  [C0402]
C519  C0402-0.47uF/6.3V  [C0402]
C520  C0402-0.47uF/6.3V  [C0402]
C600  C0402-0.47uF/6.3V  [C0402]
C601  C0402-0.47uF/6.3V  [C0402]
C602  C0402-0.47uF/6.3V  [C0402]
C603  C0402-0.47uF/6.3V  [C0402]
D2  XC7A200T-1FFG1156I  [FFG1156]  (parts N,O of 18)
R88  R0402-1K  [R0402]
R89  R0402-51K  [R0402]

### Ports
VCC_BANK0 (in), VCC_BANK12 (in), VCC_BANK13 (in), VCC_BANK14 (in), VCC_BANK15 (in), VCC_BANK16 (in), VCC_BANK17 (in), VCC_BANK32 (in), VCC_BANK33 (in), VCC_BANK34 (in), VCC_BANK35 (in), VCC_BANK36 (in), VCC_BANK37 (in), VCC_FPGA_AUX (in), VCC_FPGA_BRAM (in), VCC_FPGA_VCCINT (in), VCC_FPGA_XADC (in)

### Nets
GNDD: C117.2 C124.2 C125.2 C126.2 C127.2 C128.2 C129.2 C130.2 C131.2 C132.2 C133.2 C134.2 C135.2 C136.2 C137.2 C138.2 C139.2 C140.2 C141.2 C142.2 C143.2 C144.2 C145.2 C146.2 C147.2 C148.2 C149.2 C150.2 C151.2 C152.2 C153.2 C154.2 C155.2 C156.2 C157.2 C158.2 C159.2 C160.2 C161.2 C162.2 C163.2 C164.2 C165.2 C166.2 C167.2 C168.2 C169.2 C170.2 C171.2 C172.2 C173.2 C174.2 C175.2 C176.2 C177.2 C178.2 C179.2 C180.2 C181.2 C182.2 C183.2 C184.2 C185.2 C186.2 C187.2 C188.2 C189.2 C191.2 C192.2 C193.2 C194.2 C195.2 C196.2 C197.2 C198.2 C199.2 C200.2 C201.2 C203.2 C204.2 C205.2 C207.2 C208.2 C209.2 C210.2 C211.2 C253.2 C255.2 C259.2 C261.2 C263.2 C265.2 C368.2 C369.2 C404.2 C509.2 C510.2 C511.2 C512.2 C513.2 C514.2 C515.2 C516.2 C517.2 C518.2 C519.2 C520.2 C600.2 C601.2 C602.2 C603.2 R89.1
VCC1V0: C174.1 C175.1 C176.1 C177.1 C178.1 C189.1 C191.1 C192.1 C193.1 C201.1 C203.1 C204.1 C205.1 C207.1 C208.1 C209.1 C255.1 C259.1 C261.1 C263.1 C265.1 C368.1 C369.1 C404.1 C509.1 C516.1 C517.1 C518.1 C519.1 C520.1 C600.1 C601.1 C602.1 C603.1 D2.AA15(VCCINT) D2.AA17(VCCINT) D2.AA19(VCCINT) D2.AA21(VCCBRAM) D2.AB14(VCCINT) D2.AB16(VCCINT) D2.AB18(VCCINT) D2.AB20(VCCBRAM) D2.AC15(VCCINT) D2.AC17(VCCINT) D2.AC19(VCCINT) D2.AC21(VCCBRAM) D2.AD14(VCCINT) D2.AD16(VCCINT) D2.AD18(VCCINT) D2.AD20(VCCINT) D2.AD22(VCCINT) D2.AE15(VCCINT) D2.AE17(VCCINT) D2.AE19(VCCINT) D2.AE21(VCCINT) D2.K14(VCCINT) D2.K16(VCCINT) D2.K18(VCCINT) D2.K20(VCCINT) D2.L15(VCCINT) D2.L17(VCCINT) D2.L19(VCCINT) D2.L21(VCCINT) D2.M14(VCCINT) D2.M16(VCCINT) D2.M18(VCCINT) D2.M20(VCCBRAM) D2.N15(VCCINT) D2.N17(VCCINT) D2.N19(VCCINT) D2.N21(VCCBRAM) D2.P14(VCCINT) D2.P16(VCCINT) D2.P18(VCCINT) D2.P20(VCCBRAM) D2.R15(VCCINT) D2.R17(VCCINT) D2.R19(VCCINT) D2.R21(VCCBRAM) D2.T14(VCCINT) D2.T16(VCCINT) D2.T20(VCCBRAM) D2.U15(VCCINT) D2.U19(VCCINT) D2.U21(VCCBRAM) D2.V14(VCCINT) D2.V16(VCCINT) D2.V20(VCCBRAM) D2.W15(VCCINT) D2.W19(VCCINT) D2.W21(VCCBRAM) D2.Y14(VCCINT) D2.Y16(VCCINT) D2.Y18(VCCINT) D2.Y20(VCCBRAM) ; port VCC_FPGA_BRAM, port VCC_FPGA_VCCINT  [also labelled VCC_FPGA_BRAM, VCC_FPGA_VCCINT]
VCC1V8: C194.1 C195.1 C196.1 C197.1 C198.1 C199.1 C200.1 C510.1 C511.1 C512.1 C513.1 C514.1 C515.1 D2.AA13(VCCAUX) D2.AA23(VCCAUX) D2.AB12(VCCAUX) D2.AB22(VCCAUX) D2.AC13(VCCAUX) D2.AC23(VCCAUX) D2.AD12(VCCAUX) D2.M22(VCCAUX) D2.N13(VCCAUX) D2.N23(VCCAUX) D2.P12(VCCAUX) D2.P22(VCCAUX) D2.R13(VCCAUX) D2.R23(VCCAUX) D2.T12(VCCAUX) D2.T22(VCCAUX) D2.U13(VCCAUX) D2.U23(VCCAUX) D2.V12(VCCAUX) D2.V22(VCCAUX) D2.W13(VCCAUX) D2.W23(VCCAUX) D2.Y12(VCCAUX) D2.Y22(VCCAUX) R88.2 ; port VCC_FPGA_AUX  [also labelled VCC_FPGA_AUX]
VCC3V3: C117.1 C124.1 C125.1 C126.1 C127.1 C128.1 C129.1 C130.1 C131.1 C132.1 C133.1 C134.1 C135.1 C136.1 C137.1 C138.1 C139.1 C140.1 C141.1 C142.1 C143.1 C144.1 C145.1 C146.1 C147.1 C148.1 C149.1 C150.1 C151.1 C152.1 C153.1 C154.1 C155.1 C156.1 C157.1 C158.1 C159.1 C160.1 C161.1 C162.1 C163.1 C164.1 C165.1 C166.1 C167.1 C168.1 C169.1 C170.1 C171.1 C172.1 C173.1 C179.1 C180.1 C181.1 C182.1 C183.1 C184.1 C185.1 C186.1 C187.1 C188.1 C210.1 C253.1 D2.A6(VCCO_37) D2.A31(VCCO_17) D2.AA6(VCCO_34) D2.AA31(VCCO_14) D2.AB3(VCCO_34) D2.AB28(VCCO_14) D2.AC10(VCCO_34) D2.AC25(VCCO_13) D2.AD7(VCCO_33) D2.AD32(VCCO_13) D2.AE4(VCCO_33) D2.AE29(VCCO_13) D2.AF1(VCCO_33) D2.AF11(VCCO_33) D2.AF26(VCCO_13) D2.AG8(VCCO_33) D2.AG33(VCCO_13) D2.AH5(VCCO_33) D2.AH30(VCCO_13) D2.AJ2(VCCO_32) D2.AJ27(VCCO_12) D2.AK9(VCCO_32) D2.AK34(VCCO_12) D2.AL6(VCCO_32) D2.AL31(VCCO_12) D2.AM3(VCCO_32) D2.AM28(VCCO_12) D2.AN10(VCCO_32) D2.AN25(VCCO_12) D2.AP7(VCCO_32) D2.AP32(VCCO_12) D2.B3(VCCO_37) D2.B28(VCCO_17) D2.C10(VCCO_37) D2.C25(VCCO_17) D2.D7(VCCO_37) D2.D32(VCCO_17) D2.E4(VCCO_37) D2.E29(VCCO_17) D2.F1(VCCO_36) D2.F11(VCCO_37) D2.F26(VCCO_17) D2.G8(VCCO_36) D2.G33(VCCO_16) D2.H5(VCCO_36) D2.H30(VCCO_16) D2.J2(VCCO_36) D2.J12(VCCO_36) D2.J27(VCCO_16) D2.K9(VCCO_36) D2.K24(VCCO_16) D2.K34(VCCO_16) D2.L6(VCCO_36) D2.L13(VCCO_0) D2.L31(VCCO_16) D2.M3(VCCO_35) D2.M28(VCCO_15) D2.N10(VCCO_35) D2.N25(VCCO_15) D2.P7(VCCO_35) D2.P32(VCCO_15) D2.R4(VCCO_35) D2.R29(VCCO_15) D2.T1(VCCO_35) D2.T11(VCCO_0) D2.T18(VCCADC_0) D2.T26(VCCO_15) D2.U8(VCCO_35) D2.U33(VCCO_15) D2.V5(VCCO_34) D2.V30(VCCO_14) D2.W2(VCCO_34) D2.W27(VCCO_14) D2.Y9(VCCO_34) D2.Y24(VCCO_14) D2.Y34(VCCO_14) ; port VCC_BANK0, port VCC_FPGA_XADC, port VCC_BANK12, port VCC_BANK13, port VCC_BANK14, port VCC_BANK15, port VCC_BANK16, port VCC_BANK17, port VCC_BANK32, port VCC_BANK33, port VCC_BANK34, port VCC_BANK35, port VCC_BANK36, port VCC_BANK37  [also labelled VCC_BANK0, VCC_BANK12, VCC_BANK13, VCC_BANK14, VCC_BANK15, VCC_BANK16, VCC_BANK17, VCC_BANK32, VCC_BANK33, VCC_BANK34, VCC_BANK35, VCC_BANK36, VCC_BANK37, VCC_FPGA_XADC]
VCC_FPGA0_BATT: C211.1 D2.K13(VCCBATT_0) R88.1 R89.2

### Library data of the parts
C117 C126-C128 C131-C133 C136-C138 C141-C143 C146-C148 C151-C153 C156-C158 C161-C163 C166-C168 C171-C178 C181-C183 C186-C188 C191-C193 C196-C200 C203 C204 C207-C211 C253 C255 C259 C261 C263 C265 C368 C369 C404 C509-C520 C600-C603 = C0402-0.1uF/16V: as C6 on sheet A7_JTAG&CONFIG; Part_number: C0402-0.47uF/6.3V; Part_type: CAP; Value: C0402-0.47uF/6.3V; temperature: -55℃\+125℃; Schematic_Part: CAP; PCB_Footprint: C0402; datasheet: #DataSheet\C_Samsung_General Capacitors.pdf#
C124 C129 C134 C139 C144 C149 C154 C159 C164 C169 C179 C184 C189 C194 C201 C205 = C1210-22uF/16V: Part_number: C0805-10uF/6.3V; Part_type: CAP; Value: C0805-10uF/6.3V; Schematic_Part: CAP; PCB_Footprint: C0805
C125 C130 C135 C140 C145 C150 C155 C160 C165 C170 C180 C185 C195 = C0805-4.7uF/50V: X7R; Manufacturer: SAMSUNG; Part_number: C0805-4.7uF/16V; Part_type: CAP; Value: C0805-4.7uF/16V; Schematic_Part: CAP; PCB_Footprint: C0805; datasheet: #DataSheet\C_Samsung_General Capacitors.pdf#
D2 = XC7A200T-1FFG1156I: as D2 on sheet A7_JTAG&CONFIG; DatasheetVersion: v1.12; PackageVersion: Rev 1.8; PackageReference: FFG1156; PackageDescription: Flip-Chip BGA, Body 35 x 35 mm, 1.0 mm Pitch; CLBs (Max Distributed RAM Kb): 2888; Generic Part Number: XC7A200T; RoHS: Pb-Free; Mounting Technology: Surface Mount; Code_JEDEC: MS-034-AAR-1; PartNumber: XC7A200T-1FFG1156I; ComponentLink1Description: Datasheet; ComponentLink1URL: http://www.xilinx.com/support/documentation/data_sheets/ds180_7Series_Overview.pdf; ComponentLink2Description: Package Specification; ComponentLink2URL: http://www.xilinx.com/support/documentation/user_guides/ug475_7Series_Pkg_Pinout.pdf; ComponentLink3Description: DC and Switching Characteristics; ComponentLink3URL: http://www.xilinx.com/support/documentation/data_sheets/ds181_Artix_7_Data_Sheet.pdf; ComponentLink4Description: Package File; ComponentLink4URL: http://www.xilinx.com/support/packagefiles/a7packages/xc7a200tfbg676pkg.txt; ComponentLink5Description: Packaging and Pinout; ComponentLink5URL: http://www.xilinx.com/support/documentation/user_guides/ug475_7Series_Pkg_Pinout.pdf
R88 R89 = R0402-10K: Manufacturer: SAMSUNG; Part_type: RES; Schematic_Part: RES; PCB_Footprint: R0402
  R88: Part_number: R0402-1K; Value: R0402-1K
  R89: Part_number: R0402-51K; Value: R0402-51K

## Sheet A7_GND.SchDoc
size A3
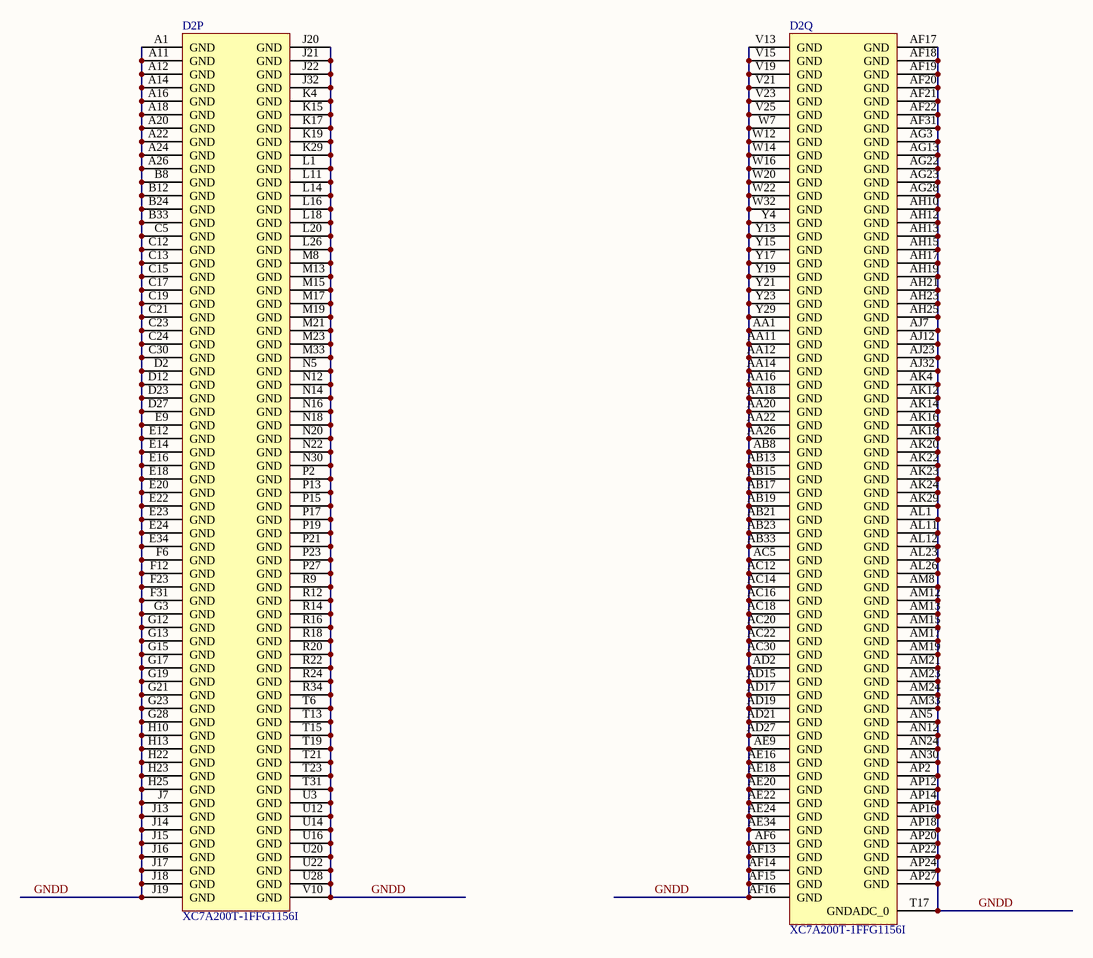
[diagram p5: A7_GND.SchDoc]

### Parts
D2  XC7A200T-1FFG1156I  [FFG1156]  (parts P,Q of 18)

### Nets
GNDD: D2.A1(GND) D2.A11(GND) D2.A12(GND) D2.A14(GND) D2.A16(GND) D2.A18(GND) D2.A20(GND) D2.A22(GND) D2.A24(GND) D2.A26(GND) D2.AA1(GND) D2.AA11(GND) D2.AA12(GND) D2.AA14(GND) D2.AA16(GND) D2.AA18(GND) D2.AA20(GND) D2.AA22(GND) D2.AA26(GND) D2.AB8(GND) D2.AB13(GND) D2.AB15(GND) D2.AB17(GND) D2.AB19(GND) D2.AB21(GND) D2.AB23(GND) D2.AB33(GND) D2.AC5(GND) D2.AC12(GND) D2.AC14(GND) D2.AC16(GND) D2.AC18(GND) D2.AC20(GND) D2.AC22(GND) D2.AC30(GND) D2.AD2(GND) D2.AD15(GND) D2.AD17(GND) D2.AD19(GND) D2.AD21(GND) D2.AD27(GND) D2.AE9(GND) D2.AE16(GND) D2.AE18(GND) D2.AE20(GND) D2.AE22(GND) D2.AE24(GND) D2.AE34(GND) D2.AF6(GND) D2.AF13(GND) D2.AF14(GND) D2.AF15(GND) D2.AF16(GND) D2.AF17(GND) D2.AF18(GND) D2.AF19(GND) D2.AF20(GND) D2.AF21(GND) D2.AF22(GND) D2.AF31(GND) D2.AG3(GND) D2.AG13(GND) D2.AG22(GND) D2.AG23(GND) D2.AG28(GND) D2.AH10(GND) D2.AH12(GND) D2.AH13(GND) D2.AH15(GND) D2.AH17(GND) D2.AH19(GND) D2.AH21(GND) D2.AH23(GND) D2.AH25(GND) D2.AJ7(GND) D2.AJ12(GND) D2.AJ23(GND) D2.AJ32(GND) D2.AK4(GND) D2.AK12(GND) D2.AK14(GND) D2.AK16(GND) D2.AK18(GND) D2.AK20(GND) D2.AK22(GND) D2.AK23(GND) D2.AK24(GND) D2.AK29(GND) D2.AL1(GND) D2.AL11(GND) D2.AL12(GND) D2.AL23(GND) D2.AL26(GND) D2.AM8(GND) D2.AM12(GND) D2.AM13(GND) D2.AM15(GND) D2.AM17(GND) D2.AM19(GND) D2.AM21(GND) D2.AM23(GND) D2.AM24(GND) D2.AM33(GND) D2.AN5(GND) D2.AN12(GND) D2.AN24(GND) D2.AN30(GND) D2.AP2(GND) D2.AP12(GND) D2.AP14(GND) D2.AP16(GND) D2.AP18(GND) D2.AP20(GND) D2.AP22(GND) D2.AP24(GND) D2.AP27(GND) D2.B8(GND) D2.B12(GND) D2.B24(GND) D2.B33(GND) D2.C5(GND) D2.C12(GND) D2.C13(GND) D2.C15(GND) D2.C17(GND) D2.C19(GND) D2.C21(GND) D2.C23(GND) D2.C24(GND) D2.C30(GND) D2.D2(GND) D2.D12(GND) D2.D23(GND) D2.D27(GND) D2.E9(GND) D2.E12(GND) D2.E14(GND) D2.E16(GND) D2.E18(GND) D2.E20(GND) D2.E22(GND) D2.E23(GND) D2.E24(GND) D2.E34(GND) D2.F6(GND) D2.F12(GND) D2.F23(GND) D2.F31(GND) D2.G3(GND) D2.G12(GND) D2.G13(GND) D2.G15(GND) D2.G17(GND) D2.G19(GND) D2.G21(GND) D2.G23(GND) D2.G28(GND) D2.H10(GND) D2.H13(GND) D2.H22(GND) D2.H23(GND) D2.H25(GND) D2.J7(GND) D2.J13(GND) D2.J14(GND) D2.J15(GND) D2.J16(GND) D2.J17(GND) D2.J18(GND) D2.J19(GND) D2.J20(GND) D2.J21(GND) D2.J22(GND) D2.J32(GND) D2.K4(GND) D2.K15(GND) D2.K17(GND) D2.K19(GND) D2.K29(GND) D2.L1(GND) D2.L11(GND) D2.L14(GND) D2.L16(GND) D2.L18(GND) D2.L20(GND) D2.L26(GND) D2.M8(GND) D2.M13(GND) D2.M15(GND) D2.M17(GND) D2.M19(GND) D2.M21(GND) D2.M23(GND) D2.M33(GND) D2.N5(GND) D2.N12(GND) D2.N14(GND) D2.N16(GND) D2.N18(GND) D2.N20(GND) D2.N22(GND) D2.N30(GND) D2.P2(GND) D2.P13(GND) D2.P15(GND) D2.P17(GND) D2.P19(GND) D2.P21(GND) D2.P23(GND) D2.P27(GND) D2.R9(GND) D2.R12(GND) D2.R14(GND) D2.R16(GND) D2.R18(GND) D2.R20(GND) D2.R22(GND) D2.R24(GND) D2.R34(GND) D2.T6(GND) D2.T13(GND) D2.T15(GND) D2.T17(GNDADC_0) D2.T19(GND) D2.T21(GND) D2.T23(GND) D2.T31(GND) D2.U3(GND) D2.U12(GND) D2.U14(GND) D2.U16(GND) D2.U20(GND) D2.U22(GND) D2.U28(GND) D2.V10(GND) D2.V13(GND) D2.V15(GND) D2.V19(GND) D2.V21(GND) D2.V23(GND) D2.V25(GND) D2.W7(GND) D2.W12(GND) D2.W14(GND) D2.W16(GND) D2.W20(GND) D2.W22(GND) D2.W32(GND) D2.Y4(GND) D2.Y13(GND) D2.Y15(GND) D2.Y17(GND) D2.Y19(GND) D2.Y21(GND) D2.Y23(GND) D2.Y29(GND)

### Library data of the parts
D2 = XC7A200T-1FFG1156I: as D2 on sheet A7_JTAG&CONFIG; DatasheetVersion: v1.12; PackageVersion: Rev 1.8; PackageReference: FFG1156; PackageDescription: Flip-Chip BGA, Body 35 x 35 mm, 1.0 mm Pitch; CLBs (Max Distributed RAM Kb): 2888; Generic Part Number: XC7A200T; RoHS: Pb-Free; Mounting Technology: Surface Mount; Code_JEDEC: MS-034-AAR-1; PartNumber: XC7A200T-1FFG1156I; ComponentLink1Description: Datasheet; ComponentLink1URL: http://www.xilinx.com/support/documentation/data_sheets/ds180_7Series_Overview.pdf; ComponentLink2Description: Package Specification; ComponentLink2URL: http://www.xilinx.com/support/documentation/user_guides/ug475_7Series_Pkg_Pinout.pdf; ComponentLink3Description: DC and Switching Characteristics; ComponentLink3URL: http://www.xilinx.com/support/documentation/data_sheets/ds181_Artix_7_Data_Sheet.pdf; ComponentLink4Description: Package File; ComponentLink4URL: http://www.xilinx.com/support/packagefiles/a7packages/xc7a200tfbg676pkg.txt; ComponentLink5Description: Packaging and Pinout; ComponentLink5URL: http://www.xilinx.com/support/documentation/user_guides/ug475_7Series_Pkg_Pinout.pdf

## Sheet A7_FUNCTION1.SchDoc
size A3
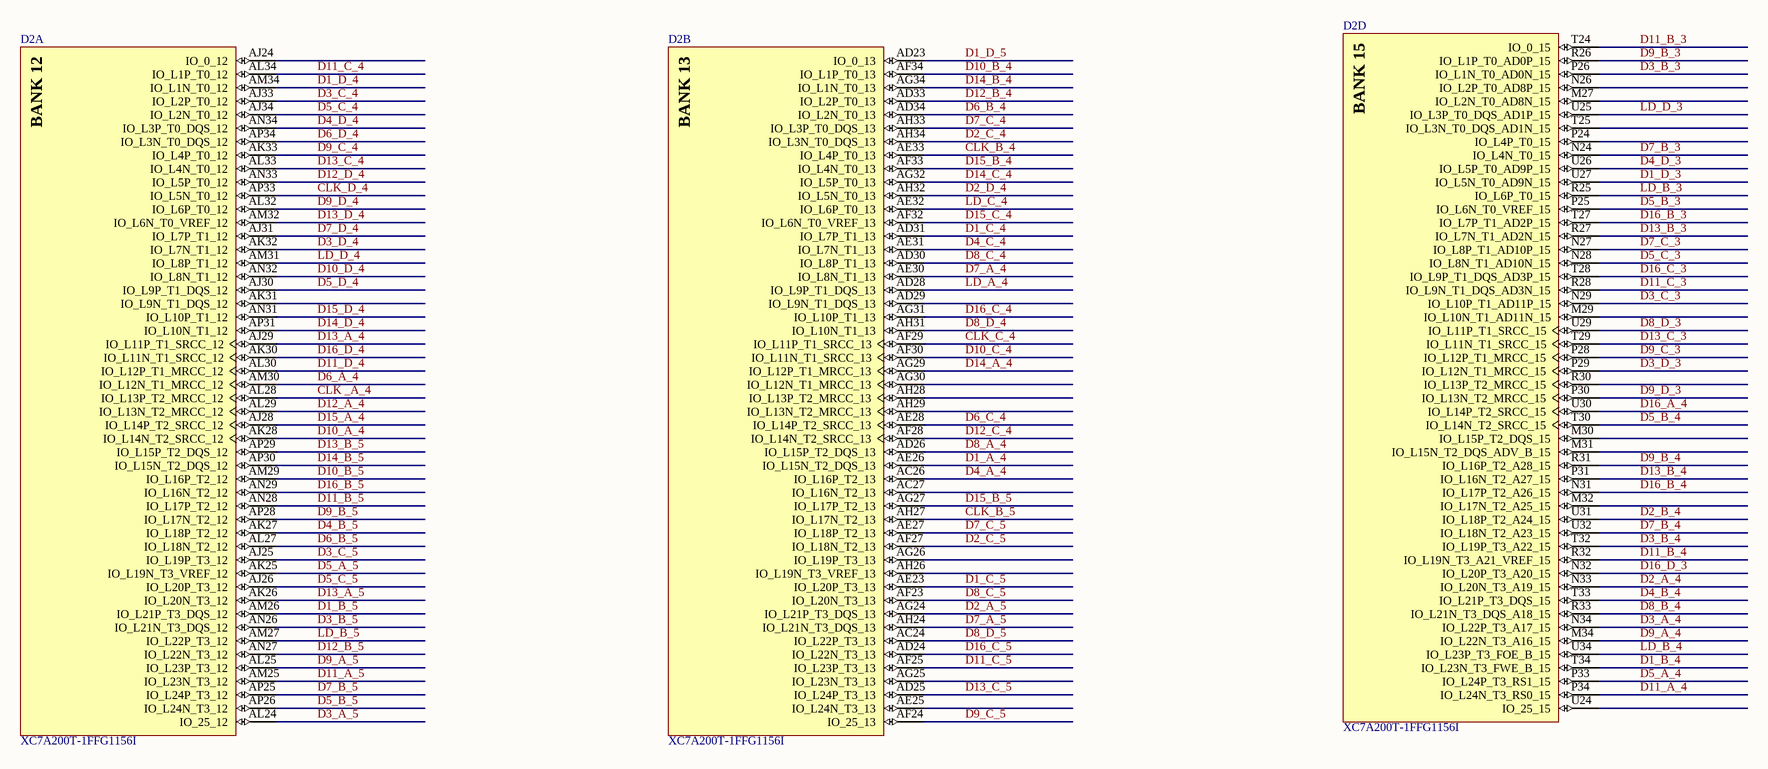
[diagram p6: A7_FUNCTION1.SchDoc]

### Parts
D2  XC7A200T-1FFG1156I  [FFG1156]  (parts A,B,D of 18)

### Nets
CLK _A_4: D2.AL28(IO_L13P_T2_MRCC_12)
CLK_B_4: D2.AE33(IO_L4P_T0_13)
CLK_B_5: D2.AH27(IO_L17N_T2_13)
CLK_C_4: D2.AF29(IO_L11P_T1_SRCC_13)
CLK_D_4: D2.AP33(IO_L5N_T0_12)
D1_A_4: D2.AE26(IO_L15N_T2_DQS_13)
D1_B_4: D2.T34(IO_L23N_T3_FWE_B_15)
D1_B_5: D2.AM26(IO_L21P_T3_DQS_12)
D1_C_4: D2.AD31(IO_L7P_T1_13)
D1_C_5: D2.AE23(IO_L20P_T3_13)
D1_D_3: D2.U27(IO_L5N_T0_AD9N_15)
D1_D_4: D2.AM34(IO_L1N_T0_12)
D1_D_5: D2.AD23(IO_0_13)
D2_A_4: D2.N33(IO_L20N_T3_A19_15)
D2_A_5: D2.AG24(IO_L21P_T3_DQS_13)
D2_B_4: D2.U31(IO_L18P_T2_A24_15)
D2_C_4: D2.AH34(IO_L3N_T0_DQS_13)
D2_C_5: D2.AF27(IO_L18N_T2_13)
D2_D_4: D2.AH32(IO_L5N_T0_13)
D3_A_4: D2.N34(IO_L22P_T3_A17_15)
D3_A_5: D2.AL24(IO_25_12)
D3_B_3: D2.P26(IO_L1N_T0_AD0N_15)
D3_B_4: D2.T32(IO_L19P_T3_A22_15)
D3_B_5: D2.AN26(IO_L21N_T3_DQS_12)
D3_C_3: D2.N29(IO_L10P_T1_AD11P_15)
D3_C_4: D2.AJ33(IO_L2P_T0_12)
D3_C_5: D2.AJ25(IO_L19P_T3_12)
D3_D_3: D2.P29(IO_L12N_T1_MRCC_15)
D3_D_4: D2.AK32(IO_L7N_T1_12)
D4_A_4: D2.AC26(IO_L16P_T2_13)
D4_B_4: D2.T33(IO_L21P_T3_DQS_15)
D4_B_5: D2.AK27(IO_L18P_T2_12)
D4_C_4: D2.AE31(IO_L7N_T1_13)
D4_D_3: D2.U26(IO_L5P_T0_AD9P_15)
D4_D_4: D2.AN34(IO_L3P_T0_DQS_12)
D5_A_4: D2.P33(IO_L24P_T3_RS1_15)
D5_A_5: D2.AK25(IO_L19N_T3_VREF_12)
D5_B_3: D2.P25(IO_L6N_T0_VREF_15)
D5_B_4: D2.T30(IO_L14N_T2_SRCC_15)
D5_B_5: D2.AP26(IO_L24N_T3_12)
D5_C_3: D2.N28(IO_L8N_T1_AD10N_15)
D5_C_4: D2.AJ34(IO_L2N_T0_12)
D5_C_5: D2.AJ26(IO_L20P_T3_12)
D5_D_4: D2.AJ30(IO_L9P_T1_DQS_12)
D6_A_4: D2.AM30(IO_L12N_T1_MRCC_12)
D6_B_4: D2.AD34(IO_L2N_T0_13)
D6_B_5: D2.AL27(IO_L18N_T2_12)
D6_C_4: D2.AE28(IO_L14P_T2_SRCC_13)
D6_D_4: D2.AP34(IO_L3N_T0_DQS_12)
D7_A_4: D2.AE30(IO_L8N_T1_13)
D7_A_5: D2.AH24(IO_L21N_T3_DQS_13)
D7_B_3: D2.N24(IO_L4N_T0_15)
D7_B_4: D2.U32(IO_L18N_T2_A23_15)
D7_B_5: D2.AP25(IO_L24P_T3_12)
D7_C_3: D2.N27(IO_L8P_T1_AD10P_15)
D7_C_4: D2.AH33(IO_L3P_T0_DQS_13)
D7_C_5: D2.AE27(IO_L18P_T2_13)
D7_D_4: D2.AJ31(IO_L7P_T1_12)
D8_A_4: D2.AD26(IO_L15P_T2_DQS_13)
D8_B_4: D2.R33(IO_L21N_T3_DQS_A18_15)
D8_C_4: D2.AD30(IO_L8P_T1_13)
D8_C_5: D2.AF23(IO_L20N_T3_13)
D8_D_3: D2.U29(IO_L11P_T1_SRCC_15)
D8_D_4: D2.AH31(IO_L10N_T1_13)
D8_D_5: D2.AC24(IO_L22P_T3_13)
D9_A_4: D2.M34(IO_L22N_T3_A16_15)
D9_A_5: D2.AL25(IO_L23P_T3_12)
D9_B_3: D2.R26(IO_L1P_T0_AD0P_15)
D9_B_4: D2.R31(IO_L16P_T2_A28_15)
D9_B_5: D2.AP28(IO_L17N_T2_12)
D9_C_3: D2.P28(IO_L12P_T1_MRCC_15)
D9_C_4: D2.AK33(IO_L4P_T0_12)
D9_C_5: D2.AF24(IO_25_13)
D9_D_3: D2.P30(IO_L13N_T2_MRCC_15)
D9_D_4: D2.AL32(IO_L6P_T0_12)
D10_A_4: D2.AK28(IO_L14N_T2_SRCC_12)
D10_B_4: D2.AF34(IO_L1P_T0_13)
D10_B_5: D2.AM29(IO_L16P_T2_12)
D10_C_4: D2.AF30(IO_L11N_T1_SRCC_13)
D10_D_4: D2.AN32(IO_L8N_T1_12)
D11_A_4: D2.P34(IO_L24N_T3_RS0_15)
D11_A_5: D2.AM25(IO_L23N_T3_12)
D11_B_3: D2.T24(IO_0_15)
D11_B_4: D2.R32(IO_L19N_T3_A21_VREF_15)
D11_B_5: D2.AN28(IO_L17P_T2_12)
D11_C_3: D2.R28(IO_L9N_T1_DQS_AD3N_15)
D11_C_4: D2.AL34(IO_L1P_T0_12)
D11_C_5: D2.AF25(IO_L23P_T3_13)
D11_D_4: D2.AL30(IO_L12P_T1_MRCC_12)
D12_A_4: D2.AL29(IO_L13N_T2_MRCC_12)
D12_B_4: D2.AD33(IO_L2P_T0_13)
D12_B_5: D2.AN27(IO_L22N_T3_12)
D12_C_4: D2.AF28(IO_L14N_T2_SRCC_13)
D12_D_4: D2.AN33(IO_L5P_T0_12)
D13_A_4: D2.AJ29(IO_L11P_T1_SRCC_12)
D13_A_5: D2.AK26(IO_L20N_T3_12)
D13_B_3: D2.R27(IO_L7N_T1_AD2N_15)
D13_B_4: D2.P31(IO_L16N_T2_A27_15)
D13_B_5: D2.AP29(IO_L15P_T2_DQS_12)
D13_C_3: D2.T29(IO_L11N_T1_SRCC_15)
D13_C_4: D2.AL33(IO_L4N_T0_12)
D13_C_5: D2.AD25(IO_L24P_T3_13)
D13_D_4: D2.AM32(IO_L6N_T0_VREF_12)
D14_A_4: D2.AG29(IO_L12P_T1_MRCC_13)
D14_B_4: D2.AG34(IO_L1N_T0_13)
D14_B_5: D2.AP30(IO_L15N_T2_DQS_12)
D14_C_4: D2.AG32(IO_L5P_T0_13)
D14_D_4: D2.AP31(IO_L10N_T1_12)
D15_A_4: D2.AJ28(IO_L14P_T2_SRCC_12)
D15_B_4: D2.AF33(IO_L4N_T0_13)
D15_B_5: D2.AG27(IO_L17P_T2_13)
D15_C_4: D2.AF32(IO_L6N_T0_VREF_13)
D15_D_4: D2.AN31(IO_L10P_T1_12)
D16_A_4: D2.U30(IO_L14P_T2_SRCC_15)
D16_B_3: D2.T27(IO_L7P_T1_AD2P_15)
D16_B_4: D2.N31(IO_L17P_T2_A26_15)
D16_B_5: D2.AN29(IO_L16N_T2_12)
D16_C_3: D2.T28(IO_L9P_T1_DQS_AD3P_15)
D16_C_4: D2.AG31(IO_L10P_T1_13)
D16_C_5: D2.AD24(IO_L22N_T3_13)
D16_D_3: D2.N32(IO_L20P_T3_A20_15)
D16_D_4: D2.AK30(IO_L11N_T1_SRCC_12)
LD_A_4: D2.AD28(IO_L9P_T1_DQS_13)
LD_B_3: D2.R25(IO_L6P_T0_15)
LD_B_4: D2.U34(IO_L23P_T3_FOE_B_15)
LD_B_5: D2.AM27(IO_L22P_T3_12)
LD_C_4: D2.AE32(IO_L6P_T0_13)
LD_D_3: D2.U25(IO_L3P_T0_DQS_AD1P_15)
LD_D_4: D2.AM31(IO_L8P_T1_12)

Not connected (* = marked no-connect by the designer): D2 AC27(IO_L16N_T2_13) AD29(IO_L9N_T1_DQS_13) AE25(IO_L24N_T3_13) AG25(IO_L23N_T3_13) AG26(IO_L19P_T3_13) AG30(IO_L12N_T1_MRCC_13) AH26(IO_L19N_T3_VREF_13) AH28(IO_L13P_T2_MRCC_13) AH29(IO_L13N_T2_MRCC_13) AJ24(IO_0_12) AK31(IO_L9N_T1_DQS_12) M27(IO_L2N_T0_AD8N_15) M29(IO_L10N_T1_AD11N_15) M30(IO_L15P_T2_DQS_15) M31(IO_L15N_T2_DQS_ADV_B_15) M32(IO_L17N_T2_A25_15) N26(IO_L2P_T0_AD8P_15) P24(IO_L4P_T0_15) R30(IO_L13P_T2_MRCC_15) T25(IO_L3N_T0_DQS_AD1N_15) U24(IO_25_15)

### Notes on the sheet
- (in symbol XC7A200T-1FFG1156I, part A) BANK 12
- (in symbol XC7A200T-1FFG1156I, part B) BANK 13
- (in symbol XC7A200T-1FFG1156I, part D) BANK 15

### Library data of the parts
D2 = XC7A200T-1FFG1156I: as D2 on sheet A7_JTAG&CONFIG; DatasheetVersion: v1.12; PackageVersion: Rev 1.8; PackageReference: FFG1156; PackageDescription: Flip-Chip BGA, Body 35 x 35 mm, 1.0 mm Pitch; CLBs (Max Distributed RAM Kb): 2888; Generic Part Number: XC7A200T; RoHS: Pb-Free; Mounting Technology: Surface Mount; Code_JEDEC: MS-034-AAR-1; PartNumber: XC7A200T-1FFG1156I; ComponentLink1Description: Datasheet; ComponentLink1URL: http://www.xilinx.com/support/documentation/data_sheets/ds180_7Series_Overview.pdf; ComponentLink2Description: Package Specification; ComponentLink2URL: http://www.xilinx.com/support/documentation/user_guides/ug475_7Series_Pkg_Pinout.pdf; ComponentLink3Description: DC and Switching Characteristics; ComponentLink3URL: http://www.xilinx.com/support/documentation/data_sheets/ds181_Artix_7_Data_Sheet.pdf; ComponentLink4Description: Package File; ComponentLink4URL: http://www.xilinx.com/support/packagefiles/a7packages/xc7a200tfbg676pkg.txt; ComponentLink5Description: Packaging and Pinout; ComponentLink5URL: http://www.xilinx.com/support/documentation/user_guides/ug475_7Series_Pkg_Pinout.pdf

## Sheet A7_FUNCTION2.SchDoc
size A3
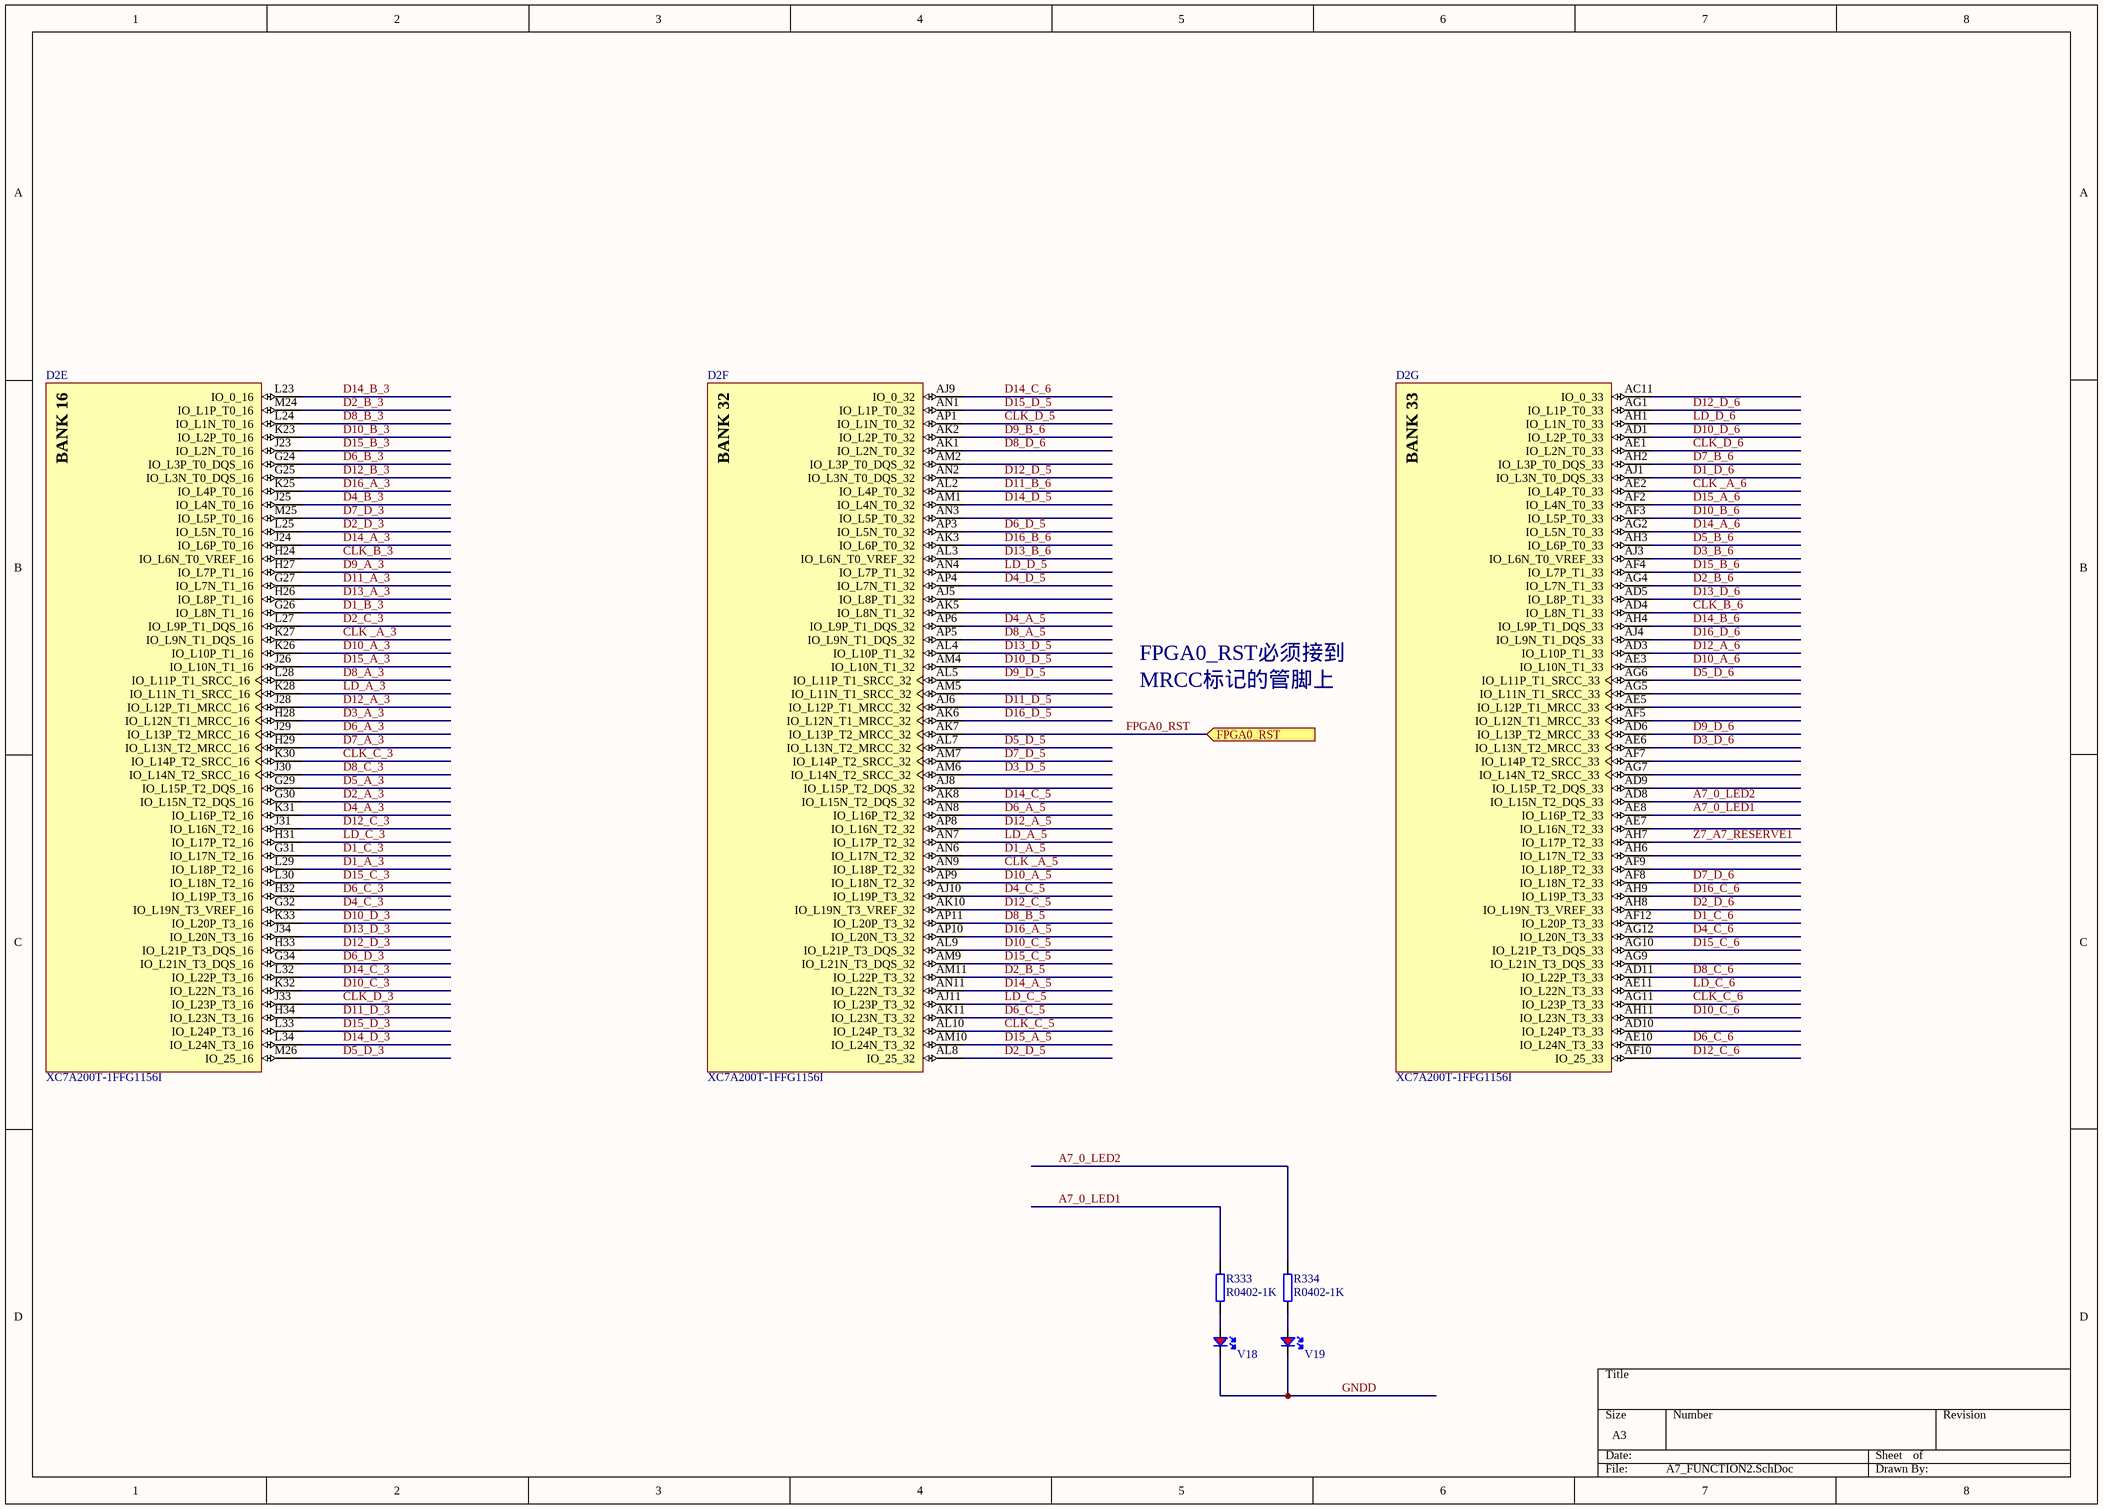
[diagram p7: A7_FUNCTION2.SchDoc]

### Parts
D2  XC7A200T-1FFG1156I  [FFG1156]  (parts E,F,G of 18)
R333  R0402-1K  [R0402]
R334  R0402-1K  [R0402]
V18  LED-R0603  [LED-R0603]  (value not drawn)
V19  LED-R0603  [LED-R0603]  (value not drawn)

### Ports
FPGA0_RST (in)

### Nets
GNDD: V18.2(K) V19.2(K)
A7_0_LED1: D2.AE8(IO_L16P_T2_33) R333.2
A7_0_LED2: D2.AD8(IO_L15N_T2_DQS_33) R334.2
CLK _A_3: D2.K27(IO_L9N_T1_DQS_16)
CLK _A_5: D2.AN9(IO_L18P_T2_32)
CLK _A_6: D2.AE2(IO_L4P_T0_33)
CLK_B_3: D2.H24(IO_L6N_T0_VREF_16)
CLK_B_6: D2.AD4(IO_L8N_T1_33)
CLK_C_3: D2.K30(IO_L14P_T2_SRCC_16)
CLK_C_5: D2.AL10(IO_L24P_T3_32)
CLK_C_6: D2.AG11(IO_L23P_T3_33)
CLK_D_3: D2.J33(IO_L23P_T3_16)
CLK_D_5: D2.AP1(IO_L1N_T0_32)
CLK_D_6: D2.AE1(IO_L2N_T0_33)
D1_A_3: D2.L29(IO_L18P_T2_16)
D1_A_5: D2.AN6(IO_L17N_T2_32)
D1_B_3: D2.G26(IO_L8N_T1_16)
D1_C_3: D2.G31(IO_L17N_T2_16)
D1_C_6: D2.AF12(IO_L20P_T3_33)
D1_D_6: D2.AJ1(IO_L3N_T0_DQS_33)
D2_A_3: D2.G30(IO_L15N_T2_DQS_16)
D2_B_3: D2.M24(IO_L1P_T0_16)
D2_B_5: D2.AM11(IO_L22P_T3_32)
D2_B_6: D2.AG4(IO_L7N_T1_33)
D2_C_3: D2.L27(IO_L9P_T1_DQS_16)
D2_D_3: D2.L25(IO_L5N_T0_16)
D2_D_5: D2.AL8(IO_25_32)
D2_D_6: D2.AH8(IO_L19N_T3_VREF_33)
D3_A_3: D2.H28(IO_L12N_T1_MRCC_16)
D3_B_6: D2.AJ3(IO_L6N_T0_VREF_33)
D3_D_5: D2.AM6(IO_L14N_T2_SRCC_32)
D3_D_6: D2.AE6(IO_L13N_T2_MRCC_33)
D4_A_3: D2.K31(IO_L16P_T2_16)
D4_A_5: D2.AP6(IO_L9P_T1_DQS_32)
D4_B_3: D2.J25(IO_L4N_T0_16)
D4_C_3: D2.G32(IO_L19N_T3_VREF_16)
D4_C_5: D2.AJ10(IO_L19P_T3_32)
D4_C_6: D2.AG12(IO_L20N_T3_33)
D4_D_5: D2.AP4(IO_L7N_T1_32)
D5_A_3: D2.G29(IO_L15P_T2_DQS_16)
D5_B_6: D2.AH3(IO_L6P_T0_33)
D5_D_3: D2.M26(IO_25_16)
D5_D_5: D2.AL7(IO_L13N_T2_MRCC_32)
D5_D_6: D2.AG6(IO_L11P_T1_SRCC_33)
D6_A_3: D2.J29(IO_L13P_T2_MRCC_16)
D6_A_5: D2.AN8(IO_L16P_T2_32)
D6_B_3: D2.G24(IO_L3P_T0_DQS_16)
D6_C_3: D2.H32(IO_L19P_T3_16)
D6_C_5: D2.AK11(IO_L23N_T3_32)
D6_C_6: D2.AE10(IO_L24N_T3_33)
D6_D_3: D2.G34(IO_L21N_T3_DQS_16)
D6_D_5: D2.AP3(IO_L5N_T0_32)
D7_A_3: D2.H29(IO_L13N_T2_MRCC_16)
D7_B_6: D2.AH2(IO_L3P_T0_DQS_33)
D7_D_3: D2.M25(IO_L5P_T0_16)
D7_D_5: D2.AM7(IO_L14P_T2_SRCC_32)
D7_D_6: D2.AF8(IO_L18N_T2_33)
D8_A_3: D2.L28(IO_L11P_T1_SRCC_16)
D8_A_5: D2.AP5(IO_L9N_T1_DQS_32)
D8_B_3: D2.L24(IO_L1N_T0_16)
D8_B_5: D2.AP11(IO_L20P_T3_32)
D8_C_3: D2.J30(IO_L14N_T2_SRCC_16)
D8_C_6: D2.AD11(IO_L22P_T3_33)
D8_D_6: D2.AK1(IO_L2N_T0_32)
D9_A_3: D2.H27(IO_L7P_T1_16)
D9_B_6: D2.AK2(IO_L2P_T0_32)
D9_D_5: D2.AL5(IO_L11P_T1_SRCC_32)
D9_D_6: D2.AD6(IO_L13P_T2_MRCC_33)
D10_A_3: D2.K26(IO_L10P_T1_16)
D10_A_5: D2.AP9(IO_L18N_T2_32)
D10_A_6: D2.AE3(IO_L10N_T1_33)
D10_B_3: D2.K23(IO_L2P_T0_16)
D10_B_6: D2.AF3(IO_L5P_T0_33)
D10_C_3: D2.K32(IO_L22N_T3_16)
D10_C_5: D2.AL9(IO_L21P_T3_DQS_32)
D10_C_6: D2.AH11(IO_L23N_T3_33)
D10_D_3: D2.K33(IO_L20P_T3_16)
D10_D_5: D2.AM4(IO_L10N_T1_32)
D10_D_6: D2.AD1(IO_L2P_T0_33)
D11_A_3: D2.G27(IO_L7N_T1_16)
D11_B_6: D2.AL2(IO_L4P_T0_32)
D11_D_3: D2.H34(IO_L23N_T3_16)
D11_D_5: D2.AJ6(IO_L12P_T1_MRCC_32)
D12_A_3: D2.J28(IO_L12P_T1_MRCC_16)
D12_A_5: D2.AP8(IO_L16N_T2_32)
D12_A_6: D2.AD3(IO_L10P_T1_33)
D12_B_3: D2.G25(IO_L3N_T0_DQS_16)
D12_C_3: D2.J31(IO_L16N_T2_16)
D12_C_5: D2.AK10(IO_L19N_T3_VREF_32)
D12_C_6: D2.AF10(IO_25_33)
D12_D_3: D2.H33(IO_L21P_T3_DQS_16)
D12_D_5: D2.AN2(IO_L3N_T0_DQS_32)
D12_D_6: D2.AG1(IO_L1P_T0_33)
D13_A_3: D2.H26(IO_L8P_T1_16)
D13_B_6: D2.AL3(IO_L6N_T0_VREF_32)
D13_D_3: D2.J34(IO_L20N_T3_16)
D13_D_5: D2.AL4(IO_L10P_T1_32)
D13_D_6: D2.AD5(IO_L8P_T1_33)
D14_A_3: D2.J24(IO_L6P_T0_16)
D14_A_5: D2.AN11(IO_L22N_T3_32)
D14_A_6: D2.AG2(IO_L5N_T0_33)
D14_B_3: D2.L23(IO_0_16)
D14_B_6: D2.AH4(IO_L9P_T1_DQS_33)
D14_C_3: D2.L32(IO_L22P_T3_16)
D14_C_5: D2.AK8(IO_L15N_T2_DQS_32)
D14_C_6: D2.AJ9(IO_0_32)
D14_D_3: D2.L34(IO_L24N_T3_16)
D14_D_5: D2.AM1(IO_L4N_T0_32)
D15_A_3: D2.J26(IO_L10N_T1_16)
D15_A_5: D2.AM10(IO_L24N_T3_32)
D15_A_6: D2.AF2(IO_L4N_T0_33)
D15_B_3: D2.J23(IO_L2N_T0_16)
D15_B_6: D2.AF4(IO_L7P_T1_33)
D15_C_3: D2.L30(IO_L18N_T2_16)
D15_C_5: D2.AM9(IO_L21N_T3_DQS_32)
D15_C_6: D2.AG10(IO_L21P_T3_DQS_33)
D15_D_3: D2.L33(IO_L24P_T3_16)
D15_D_5: D2.AN1(IO_L1P_T0_32)
D16_A_3: D2.K25(IO_L4P_T0_16)
D16_A_5: D2.AP10(IO_L20N_T3_32)
D16_B_6: D2.AK3(IO_L6P_T0_32)
D16_C_6: D2.AH9(IO_L19P_T3_33)
D16_D_5: D2.AK6(IO_L12N_T1_MRCC_32)
D16_D_6: D2.AJ4(IO_L9N_T1_DQS_33)
FPGA0_RST: D2.AK7(IO_L13P_T2_MRCC_32) ; port FPGA0_RST
LD_A_3: D2.K28(IO_L11N_T1_SRCC_16)
LD_A_5: D2.AN7(IO_L17P_T2_32)
LD_C_3: D2.H31(IO_L17P_T2_16)
LD_C_5: D2.AJ11(IO_L23P_T3_32)
LD_C_6: D2.AE11(IO_L22N_T3_33)
LD_D_5: D2.AN4(IO_L7P_T1_32)
LD_D_6: D2.AH1(IO_L1N_T0_33)
Z7_A7_RESERVE1: D2.AH7(IO_L17P_T2_33)
NetR333_1: R333.1 V18.1(A)
NetR334_1: R334.1 V19.1(A)

Not connected (* = marked no-connect by the designer): D2 AC11(IO_0_33) AD9(IO_L15P_T2_DQS_33) AD10(IO_L24P_T3_33) AE5(IO_L12P_T1_MRCC_33) AE7(IO_L16N_T2_33) AF5(IO_L12N_T1_MRCC_33) AF7(IO_L14P_T2_SRCC_33) AF9(IO_L18P_T2_33) AG5(IO_L11N_T1_SRCC_33) AG7(IO_L14N_T2_SRCC_33) AG9(IO_L21N_T3_DQS_33) AH6(IO_L17N_T2_33) AJ5(IO_L8P_T1_32) AJ8(IO_L15P_T2_DQS_32) AK5(IO_L8N_T1_32) AM2(IO_L3P_T0_DQS_32) AM5(IO_L11N_T1_SRCC_32) AN3(IO_L5P_T0_32)

### Notes on the sheet
- FPGA0_RST必须接到
- MRCC标记的管脚上
- (in symbol XC7A200T-1FFG1156I, part E) BANK 16
- (in symbol XC7A200T-1FFG1156I, part F) BANK 32
- (in symbol XC7A200T-1FFG1156I, part G) BANK 33

### Library data of the parts
D2 = XC7A200T-1FFG1156I: as D2 on sheet A7_JTAG&CONFIG; DatasheetVersion: v1.12; PackageVersion: Rev 1.8; PackageReference: FFG1156; PackageDescription: Flip-Chip BGA, Body 35 x 35 mm, 1.0 mm Pitch; CLBs (Max Distributed RAM Kb): 2888; Generic Part Number: XC7A200T; RoHS: Pb-Free; Mounting Technology: Surface Mount; Code_JEDEC: MS-034-AAR-1; PartNumber: XC7A200T-1FFG1156I; ComponentLink1Description: Datasheet; ComponentLink1URL: http://www.xilinx.com/support/documentation/data_sheets/ds180_7Series_Overview.pdf; ComponentLink2Description: Package Specification; ComponentLink2URL: http://www.xilinx.com/support/documentation/user_guides/ug475_7Series_Pkg_Pinout.pdf; ComponentLink3Description: DC and Switching Characteristics; ComponentLink3URL: http://www.xilinx.com/support/documentation/data_sheets/ds181_Artix_7_Data_Sheet.pdf; ComponentLink4Description: Package File; ComponentLink4URL: http://www.xilinx.com/support/packagefiles/a7packages/xc7a200tfbg676pkg.txt; ComponentLink5Description: Packaging and Pinout; ComponentLink5URL: http://www.xilinx.com/support/documentation/user_guides/ug475_7Series_Pkg_Pinout.pdf
R333 R334 = R0402-10K: Manufacturer: SAMSUNG; Part_number: R0402-1K; Part_type: RES; Value: R0402-1K; Schematic_Part: RES; PCB_Footprint: R0402
V18 V19 = LED-R0603: 表贴发光二极管, 0603封装, 体积1.6x0.8mm, 红色, 高度0.8mm; Part_type: DIODES; Part_number: LED-R0603; Value: LED-R0603; Schematic_Part: LED-R; PCB_Footprint: LED-R0603